# EAGLE design Board 2 (EAGLE 9.1.1)
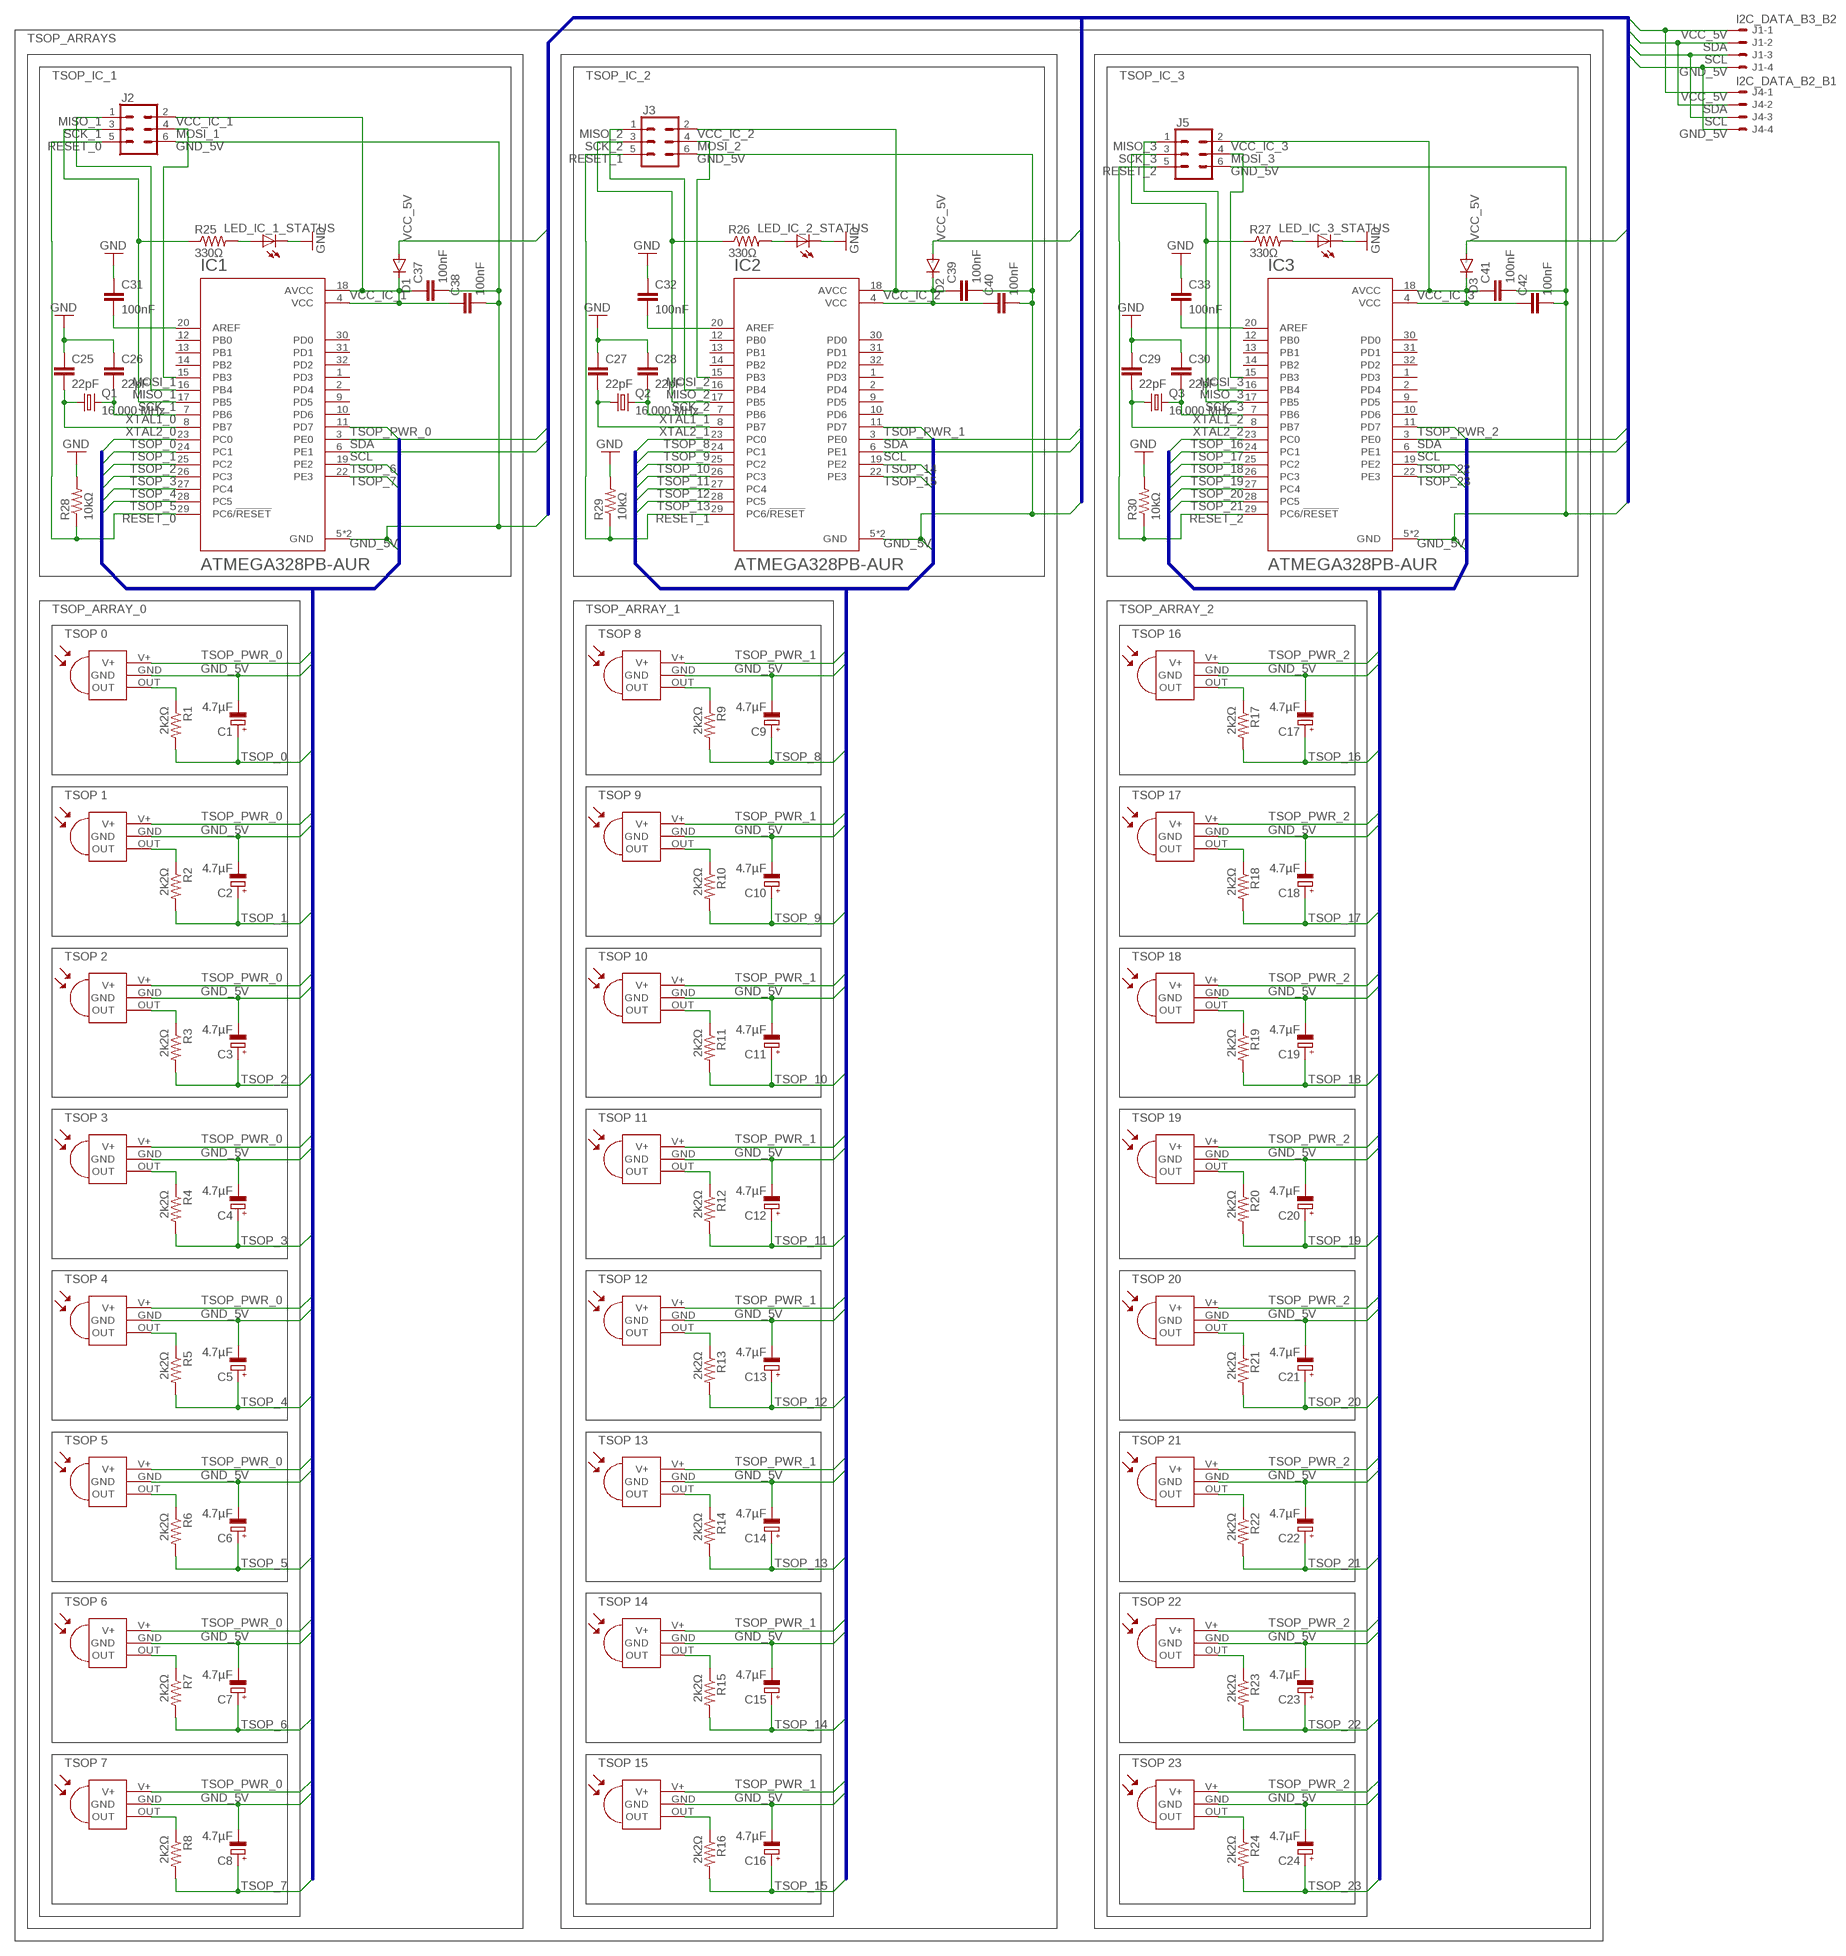
[diagram p0: schematic, sheet 1]

## Parts
C1  4.7µF  CPOL-EUE2-5  [E2-5]
C2  4.7µF  CPOL-EUE2-5  [E2-5]
C3  4.7µF  CPOL-EUE2-5  [E2-5]
C4  4.7µF  CPOL-EUE2-5  [E2-5]
C5  4.7µF  CPOL-EUE2-5  [E2-5]
C6  4.7µF  CPOL-EUE2-5  [E2-5]
C7  4.7µF  CPOL-EUE2-5  [E2-5]
C8  4.7µF  CPOL-EUE2-5  [E2-5]
C9  4.7µF  CPOL-EUE2-5  [E2-5]
C10  4.7µF  CPOL-EUE2-5  [E2-5]
C11  4.7µF  CPOL-EUE2-5  [E2-5]
C12  4.7µF  CPOL-EUE2-5  [E2-5]
C13  4.7µF  CPOL-EUE2-5  [E2-5]
C14  4.7µF  CPOL-EUE2-5  [E2-5]
C15  4.7µF  CPOL-EUE2-5  [E2-5]
C16  4.7µF  CPOL-EUE2-5  [E2-5]
C17  4.7µF  CPOL-EUE2-5  [E2-5]
C18  4.7µF  CPOL-EUE2-5  [E2-5]
C19  4.7µF  CPOL-EUE2-5  [E2-5]
C20  4.7µF  CPOL-EUE2-5  [E2-5]
C21  4.7µF  CPOL-EUE2-5  [E2-5]
C22  4.7µF  CPOL-EUE2-5  [E2-5]
C23  4.7µF  CPOL-EUE2-5  [E2-5]
C24  4.7µF  CPOL-EUE2-5  [E2-5]
C25  22pF  C-EU050-024X044  [C050-024X044]
C26  22pF  C-EU050-024X044  [C050-024X044]
C27  22pF  C-EU050-024X044  [C050-024X044]
C28  22pF  C-EU050-024X044  [C050-024X044]
C29  22pF  C-EU050-024X044  [C050-024X044]
C30  22pF  C-EU050-024X044  [C050-024X044]
C31  100nF  C-EU050-024X044  [C050-024X044]
C32  100nF  C-EU050-024X044  [C050-024X044]
C33  100nF  C-EU050-024X044  [C050-024X044]
C37  100nF  C-EU050-024X044  [C050-024X044]
C38  100nF  C-EU050-024X044  [C050-024X044]
C39  100nF  C-EU050-024X044  [C050-024X044]
C40  100nF  C-EU050-024X044  [C050-024X044]
C41  100nF  C-EU050-024X044  [C050-024X044]
C42  100nF  C-EU050-024X044  [C050-024X044]
D1  1N4148DO35-7  [DO35-7]
D2  1N4148DO35-7  [DO35-7]
D3  1N4148DO35-7  [DO35-7]
IC1  ATMEGA328PB-AUR  [QFP80P900X900X120-32N]
IC2  ATMEGA328PB-AUR  [QFP80P900X900X120-32N]
IC3  ATMEGA328PB-AUR  [QFP80P900X900X120-32N]
J1  I2C_DATA_B3_B2  22-27-2041-04  [6410-04]
J2  CONN_03X2SHROUD  [2X3-SHROUDED]
J3  CONN_03X2SHROUD  [2X3-SHROUDED]
J4  I2C_DATA_B2_B1  22-27-2041-04  [6410-04]
J5  CONN_03X2SHROUD  [2X3-SHROUDED]
LED_IC_1_STATUS  LEDP-LCC-2  [P-LCC-2]
LED_IC_2_STATUS  LEDP-LCC-2  [P-LCC-2]
LED_IC_3_STATUS  LEDP-LCC-2  [P-LCC-2]
Q1  16.000 MHz  CRYSTALHC49U-V  [HC49U-V]
Q2  16.000 MHz  CRYSTALHC49U-V  [HC49U-V]
Q3  16.000 MHz  CRYSTALHC49U-V  [HC49U-V]
R1  2k2Ω  R-US_0207/10  [0207/10]
R2  2k2Ω  R-US_0207/10  [0207/10]
R3  2k2Ω  R-US_0207/10  [0207/10]
R4  2k2Ω  R-US_0207/10  [0207/10]
R5  2k2Ω  R-US_0207/10  [0207/10]
R6  2k2Ω  R-US_0207/10  [0207/10]
R7  2k2Ω  R-US_0207/10  [0207/10]
R8  2k2Ω  R-US_0207/10  [0207/10]
R9  2k2Ω  R-US_0207/10  [0207/10]
R10  2k2Ω  R-US_0207/10  [0207/10]
R11  2k2Ω  R-US_0207/10  [0207/10]
R12  2k2Ω  R-US_0207/10  [0207/10]
R13  2k2Ω  R-US_0207/10  [0207/10]
R14  2k2Ω  R-US_0207/10  [0207/10]
R15  2k2Ω  R-US_0207/10  [0207/10]
R16  2k2Ω  R-US_0207/10  [0207/10]
R17  2k2Ω  R-US_0207/10  [0207/10]
R18  2k2Ω  R-US_0207/10  [0207/10]
R19  2k2Ω  R-US_0207/10  [0207/10]
R20  2k2Ω  R-US_0207/10  [0207/10]
R21  2k2Ω  R-US_0207/10  [0207/10]
R22  2k2Ω  R-US_0207/10  [0207/10]
R23  2k2Ω  R-US_0207/10  [0207/10]
R24  2k2Ω  R-US_0207/10  [0207/10]
R25  330Ω  R-US_0207/10  [0207/10]
R26  330Ω  R-US_0207/10  [0207/10]
R27  330Ω  R-US_0207/10  [0207/10]
R28  10kΩ  R-US_0207/10  [0207/10]
R29  10kΩ  R-US_0207/10  [0207/10]
R30  10kΩ  R-US_0207/10  [0207/10]
TSOP_1  TSOP14340  [TSOP143XX]
TSOP_2  TSOP14340  [TSOP143XX]
TSOP_3  TSOP14340  [TSOP143XX]
TSOP_4  TSOP14340  [TSOP143XX]
TSOP_5  TSOP14340  [TSOP143XX]
TSOP_6  TSOP14340  [TSOP143XX]
TSOP_7  TSOP14340  [TSOP143XX]
TSOP_8  TSOP14340  [TSOP143XX]
TSOP_9  TSOP14340  [TSOP143XX]
TSOP_10  TSOP14340  [TSOP143XX]
TSOP_11  TSOP14340  [TSOP143XX]
TSOP_12  TSOP14340  [TSOP143XX]
TSOP_13  TSOP14340  [TSOP143XX]
TSOP_14  TSOP14340  [TSOP143XX]
TSOP_15  TSOP14340  [TSOP143XX]
TSOP_16  TSOP14340  [TSOP143XX]
TSOP_17  TSOP14340  [TSOP143XX]
TSOP_18  TSOP14340  [TSOP143XX]
TSOP_19  TSOP14340  [TSOP143XX]
TSOP_20  TSOP14340  [TSOP143XX]
TSOP_21  TSOP14340  [TSOP143XX]
TSOP_22  TSOP14340  [TSOP143XX]
TSOP_23  TSOP14340  [TSOP143XX]
TSOP_24  TSOP14340  [TSOP143XX]

## Nets
GND_5V [+5V Power]: C1.- C2.- C3.- C4.- C5.- C6.- C7.- C8.- C9.- C10.- C11.- C12.- C13.- C14.- C15.- C16.- C17.- C18.- C19.- C20.- C21.- C22.- C23.- C24.- C25.1 C26.1 C27.1 C28.1 C29.1 C30.1 C31.1 C32.1 C33.1 C37.2 C38.2 C39.2 C40.2 C41.2 C42.2 IC1.5(GND) IC1.21(GND) IC2.5(GND) IC2.21(GND) IC3.5(GND) IC3.21(GND) J1.4 J2.6 J3.6 J4.4 J5.6 LED_IC_1_STATUS.C LED_IC_2_STATUS.C LED_IC_3_STATUS.C R28.2 R29.2 R30.2 TSOP_1.GND TSOP_2.GND TSOP_3.GND TSOP_4.GND TSOP_5.GND TSOP_6.GND TSOP_7.GND TSOP_8.GND TSOP_9.GND TSOP_10.GND TSOP_11.GND TSOP_12.GND TSOP_13.GND TSOP_14.GND TSOP_15.GND TSOP_16.GND TSOP_17.GND TSOP_18.GND TSOP_19.GND TSOP_20.GND TSOP_21.GND TSOP_22.GND TSOP_23.GND TSOP_24.GND ; supply symbol labelled GND
MISO_1: IC1.16(PB4) J2.1
MISO_2: IC2.16(PB4) J3.1
MISO_3: IC3.16(PB4) J5.1
MOSI_1: IC1.15(PB3) J2.4
MOSI_2: IC2.15(PB3) J3.4
MOSI_3: IC3.15(PB3) J5.4
N$1: R1.1 TSOP_1.OUT
N$2: R2.1 TSOP_2.OUT
N$3: R3.1 TSOP_3.OUT
N$4: R4.1 TSOP_4.OUT
N$5: R5.1 TSOP_5.OUT
N$6: R6.1 TSOP_6.OUT
N$7: R7.1 TSOP_7.OUT
N$8: R8.1 TSOP_8.OUT
N$9: R9.1 TSOP_9.OUT
N$10: R10.1 TSOP_10.OUT
N$11: R11.1 TSOP_11.OUT
N$12: R12.1 TSOP_12.OUT
N$13: R13.1 TSOP_13.OUT
N$14: R14.1 TSOP_14.OUT
N$15: R15.1 TSOP_15.OUT
N$16: R16.1 TSOP_16.OUT
N$17: R17.1 TSOP_17.OUT
N$18: R18.1 TSOP_18.OUT
N$19: R19.1 TSOP_19.OUT
N$20: R20.1 TSOP_20.OUT
N$21: R21.1 TSOP_21.OUT
N$22: R22.1 TSOP_22.OUT
N$23: R23.1 TSOP_23.OUT
N$24: R24.1 TSOP_24.OUT
N$25: LED_IC_1_STATUS.A R25.2
N$26: C31.2 IC1.20(AREF)
N$27: LED_IC_2_STATUS.A R26.2
N$28: C32.2 IC2.20(AREF)
N$29: LED_IC_3_STATUS.A R27.2
N$30: C33.2 IC3.20(AREF)
RESET_0: IC1.29(PC6/!RESET) J2.5 R28.1
RESET_1: IC2.29(PC6/!RESET) J3.5 R29.1
RESET_2: IC3.29(PC6/!RESET) J5.5 R30.1
SCK_1: IC1.17(PB5) J2.3 R25.1
SCK_2: IC2.17(PB5) J3.3 R26.1
SCK_3: IC3.17(PB5) J5.3 R27.1
SCL: IC1.6(PE1) IC2.6(PE1) IC3.6(PE1) J1.3 J4.3
SDA: IC1.3(PE0) IC2.3(PE0) IC3.3(PE0) J1.2 J4.2
TSOP_0: C1.+ IC1.23(PC0) R1.2
TSOP_1: C2.+ IC1.24(PC1) R2.2
TSOP_2: C3.+ IC1.25(PC2) R3.2
TSOP_3: C4.+ IC1.26(PC3) R4.2
TSOP_4: C5.+ IC1.27(PC4) R5.2
TSOP_5: C6.+ IC1.28(PC5) R6.2
TSOP_6: C7.+ IC1.19(PE2) R7.2
TSOP_7: C8.+ IC1.22(PE3) R8.2
TSOP_8: C9.+ IC2.23(PC0) R9.2
TSOP_9: C10.+ IC2.24(PC1) R10.2
TSOP_10: C11.+ IC2.25(PC2) R11.2
TSOP_11: C12.+ IC2.26(PC3) R12.2
TSOP_12: C13.+ IC2.27(PC4) R13.2
TSOP_13: C14.+ IC2.28(PC5) R14.2
TSOP_14: C15.+ IC2.19(PE2) R15.2
TSOP_15: C16.+ IC2.22(PE3) R16.2
TSOP_16: C17.+ IC3.23(PC0) R17.2
TSOP_17: C18.+ IC3.24(PC1) R18.2
TSOP_18: C19.+ IC3.25(PC2) R19.2
TSOP_19: C20.+ IC3.26(PC3) R20.2
TSOP_20: C21.+ IC3.27(PC4) R21.2
TSOP_21: C22.+ IC3.28(PC5) R22.2
TSOP_22: C23.+ IC3.19(PE2) R23.2
TSOP_23: C24.+ IC3.22(PE3) R24.2
TSOP_PWR_0: IC1.11(PD7) TSOP_1.V+ TSOP_2.V+ TSOP_3.V+ TSOP_4.V+ TSOP_5.V+ TSOP_6.V+ TSOP_7.V+ TSOP_8.V+
TSOP_PWR_1: IC2.11(PD7) TSOP_9.V+ TSOP_10.V+ TSOP_11.V+ TSOP_12.V+ TSOP_13.V+ TSOP_14.V+ TSOP_15.V+ TSOP_16.V+
TSOP_PWR_2: IC3.11(PD7) TSOP_17.V+ TSOP_18.V+ TSOP_19.V+ TSOP_20.V+ TSOP_21.V+ TSOP_22.V+ TSOP_23.V+ TSOP_24.V+
VCC_5V [+5V Power]: D1.A D2.A D3.A J1.1 J4.1
VCC_IC_1 [+5V Power]: C37.1 C38.1 D1.C IC1.4(VCC) IC1.18(AVCC) J2.2
VCC_IC_2 [+5V Power]: C39.1 C40.1 D2.C IC2.4(VCC) IC2.18(AVCC) J3.2
VCC_IC_3 [+5V Power]: C41.1 C42.1 D3.C IC3.4(VCC) IC3.18(AVCC) J5.2
XTAL1_0: C26.2 IC1.7(PB6) Q1.2
XTAL1_1: C28.2 IC2.7(PB6) Q2.2
XTAL1_2: C30.2 IC3.7(PB6) Q3.2
XTAL2_0: C25.2 IC1.8(PB7) Q1.1
XTAL2_1: C27.2 IC2.8(PB7) Q2.1
XTAL2_2: C29.2 IC3.8(PB7) Q3.1
Unconnected: IC1.1(PD3) IC1.2(PD4) IC1.9(PD5) IC1.10(PD6) IC1.12(PB0) IC1.13(PB1) IC1.14(PB2) IC1.30(PD0) IC1.31(PD1) IC1.32(PD2) IC2.1(PD3) IC2.2(PD4) IC2.9(PD5) IC2.10(PD6) IC2.12(PB0) IC2.13(PB1) IC2.14(PB2) IC2.30(PD0) IC2.31(PD1) IC2.32(PD2) IC3.1(PD3) IC3.2(PD4) IC3.9(PD5) IC3.10(PD6) IC3.12(PB0) IC3.13(PB1) IC3.14(PB2) IC3.30(PD0) IC3.31(PD1) IC3.32(PD2)

## Buses
TSOP_ARRAY_0:GND,TSOP_[0..7],TSOP_PWR_0
TSOP_ARRAY_1:GND,TSOP_[8..15],TSOP_PWR_1
TSOP_ARRAY_2:GND,TSOP_[16..23],TSOP_PWR_2
I2C:GND,SCL,SDA,VCC_MEGA

## Notes on the sheet
- TSOP_ARRAYS
- TSOP_IC_1 | TSOP_IC_2 | TSOP_IC_3
- TSOP_ARRAY_0 | TSOP_ARRAY_1 | TSOP_ARRAY_2
- TSOP 0 | TSOP 8 | TSOP 16
- TSOP 1 | TSOP 9 | TSOP 17
- TSOP 2 | TSOP 10 | TSOP 18
- TSOP 3 | TSOP 11 | TSOP 19
- TSOP 4 | TSOP 12 | TSOP 20
- TSOP 5 | TSOP 13 | TSOP 21
- TSOP 6 | TSOP 14 | TSOP 22
- TSOP 7 | TSOP 15 | TSOP 23

## Library data of the parts
C1-C24 = rcl:CPOL-EU: POLARIZED CAPACITOR, European symbol; SPICEPREFIX: C
C25-C33 C37-C42 = rcl:C-EU: CAPACITOR, European symbol; SPICEPREFIX: C
D1-D3 = diode:1N4148: DIODE high speed (Philips)
IC1-IC3 = ATMEGA328PB-AUR:ATMEGA328PB-AUR: ATmega Series 20 MHz 32 KB Flash 2 KB SRAM 8-Bit Microcontroller - TQFP-32; AVAILABILITY: Unavailable; DESCRIPTION: AVR microcontroller; EEPROM: 1024B; SRAM: 2kB; Flash: 32kB; TQFP32; MF: Microchip; MP: ATMEGA328PB-AUR; PACKAGE: TQFP-32 Microchip; PRICE: None
J1 J4 = con-molex:22-?-04: CONNECTOR wire to board 2.54 mm (.1 inch) pitch header; MF: MOLEX; OC_FARNELL: unknown; OC_NEWARK: unknown
J2 J3 J5 = SparkFun-Connectors:CONN_03X2: Multi connection point. Often used as Generic Header-pin footprint for 0.1 inch spaced/style header connections You can populate with any combo of single row headers, but if you'd like an exact match, check these: Header - 2x3 (Male, 0.1") <https://www.sparkfun.com/products/12807> (PRT-12807) Header - 2x3 (Female, 0.1") <https://www.sparkfun.com/products/13010> (PRT-13010) 2x3 Pin Shrouded Header <https://www.sparkfun.com/products/10877> (PRT-10877) On any of the 0.1 inch spaced packages, you can populate with these: Break Away Headers - Straight <https://www.sparkfun.com/products/116> (PRT-00116) Break Away Male Headers - Right Angle <https://www.sparkfun.com/products/553> (PRT-00553) Female Headers <https://www.sparkfun.com/products/115> (PRT-00115) Break Away Headers - Machine Pin <https://www.sparkfun.com/products/117> (PRT-00117) Break Away Female Headers - Swiss Machine Pin <https://www.sparkfun.com/products/743> (PRT-00743) Special note: the shrouded connector mates well with our 3x2 ribbon cables: Ribbon Crimp Connector - 6-pin (2x3, Female) <https://www.sparkfun.com/products/10651> (PRT-10651) Ribbon Cable - 6 wire (15ft) <https://www.sparkfun.com/products/10646> (PRT-10646); PROD_ID: CONN-10681; SF_ID: PRT_10877
LED_IC_1_STATUS LED_IC_2_STATUS LED_IC_3_STATUS = adafruit:LED: LED OSRAM: - CHIPLED LG R971, LG N971, LY N971, LG Q971, LY Q971, LO R971, LY R971 LH N974, LH R974 LS Q976, LO Q976, LY Q976 LO Q996 - Hyper CHIPLED LW Q18S LB Q993, LB Q99A, LB R99A - SideLED LS A670, LO A670, LY A670, LG A670, LP A670 LB A673, LV A673, LT A673, LW A673 LH A674 LY A675 LS A676, LA A676, LO A676, LY A676, LW A676 LS A679, LY A679, LG A679 - Hyper Micro SIDELED® LS Y876, LA Y876, LO Y876, LY Y876 LT Y87S - SmartLED LW L88C, LW L88S LB L89C, LB L89S, LG L890 LS L89K, LO L89K, LY L89K LS L896, LA L896, LO L896, LY L896 - TOPLED LS T670, LO T670, LY T670, LG T670, LP T670 LSG T670, LSP T670, LSY T670, LOP T670, LYG T670 LG T671, LOG T671, LSG T671 LB T673, LV T673, LT T673, LW T673 LH T674 LS T676, LA T676, LO T676, LY T676, LB T676, LH T676, LSB T676, LW T676 LB T67C, LV T67C, LT T67C, LS T67K, LO T67K, LY T67K, LW E67C LS E67B, LA E67B, LO E67B, LY E67B, LB E67C, LV E67C, LT E67C LW T67C LS T679, LY T679, LG T679 LS T770, LO T770, LY T770, LG T770, LP T770 LB T773, LV T773, LT T773, LW T773 LH T774 LS E675, LA E675, LY E675, LS T675 LS T776, LA T776, LO T776, LY T776, LB T776 LHGB T686 LT T68C, LB T68C - Hyper Mini TOPLED® LB M676 - Mini TOPLED Santana® LG M470 LS M47K, LO M47K, LY M47K Source: http://www.osram.convergy.de/
Q1-Q3 = crystal:CRYSTAL: CRYSTAL; OC_FARNELL: 1666969; OC_NEWARK: unknown
R1-R30 = resistor:R-US_: RESISTOR, American symbol
TSOP_1-TSOP_24 = TSOP 14340:TSOP14340

## Net classes
1 +12V Power: width 2.032 mm, drill 1.397 mm, clearance 0.356 mm
2 +5V Power: width 0.508 mm, drill 0.61 mm, clearance 0.203 mm

## Board
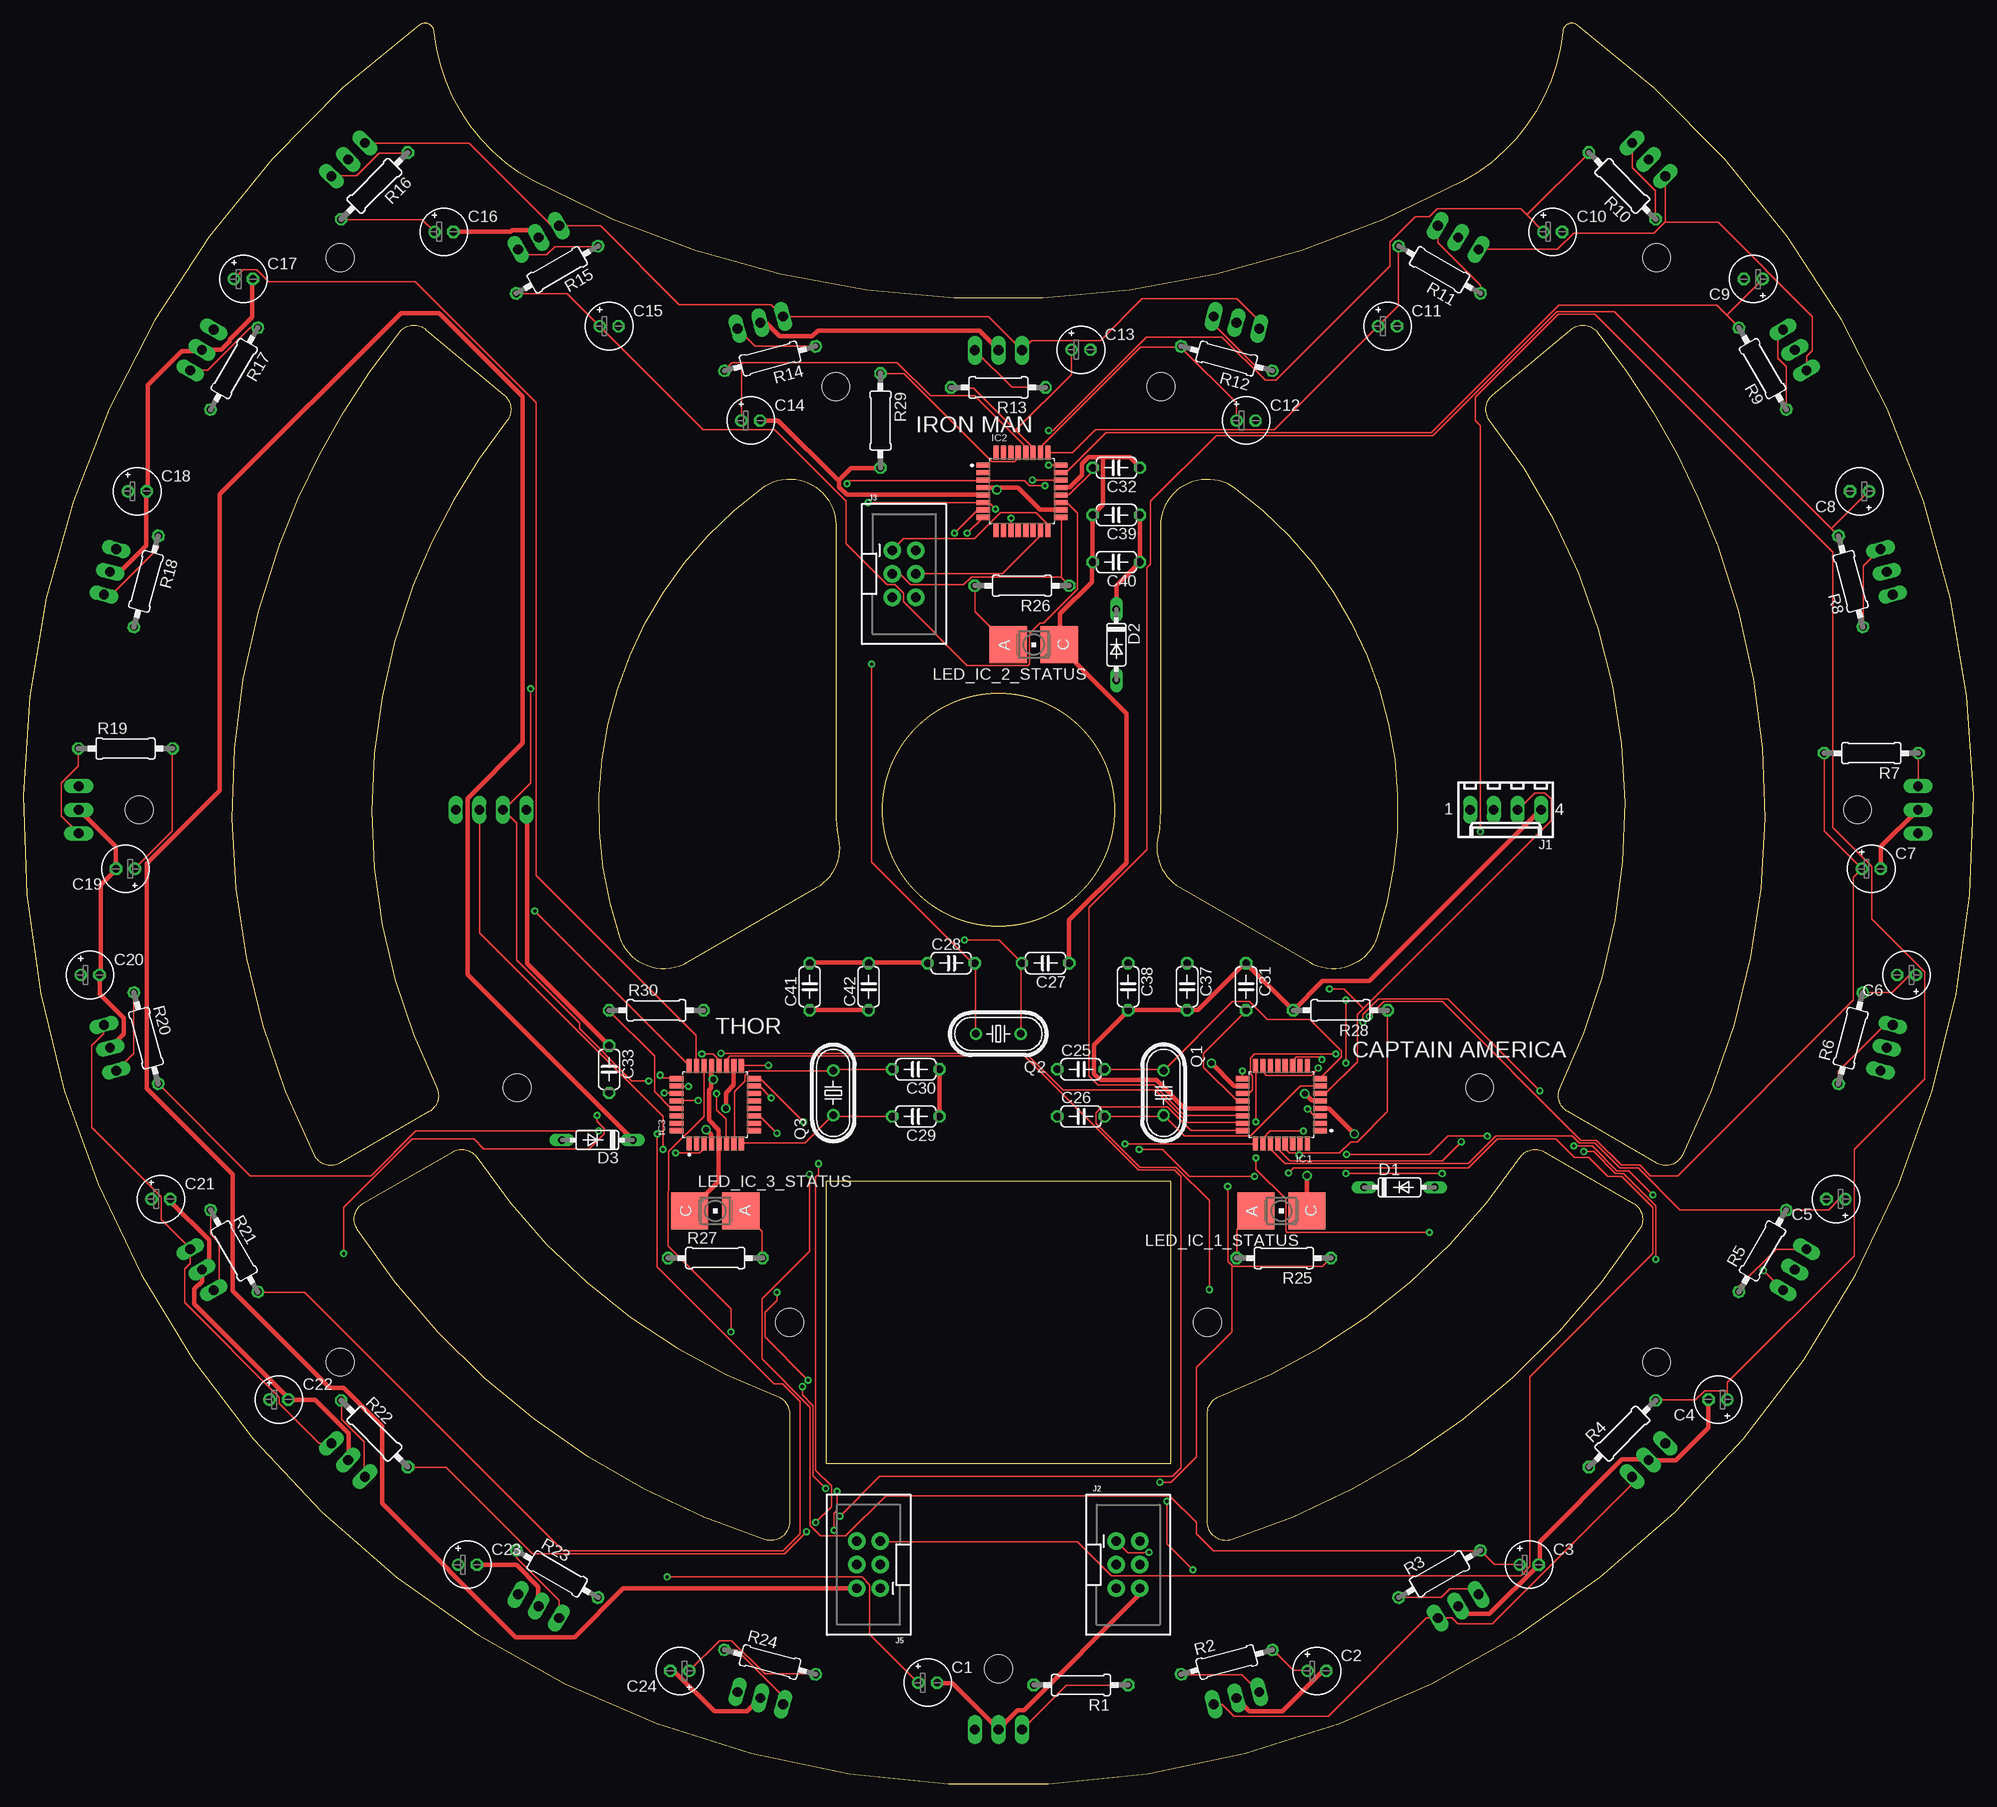
[diagram p1: board, top side]
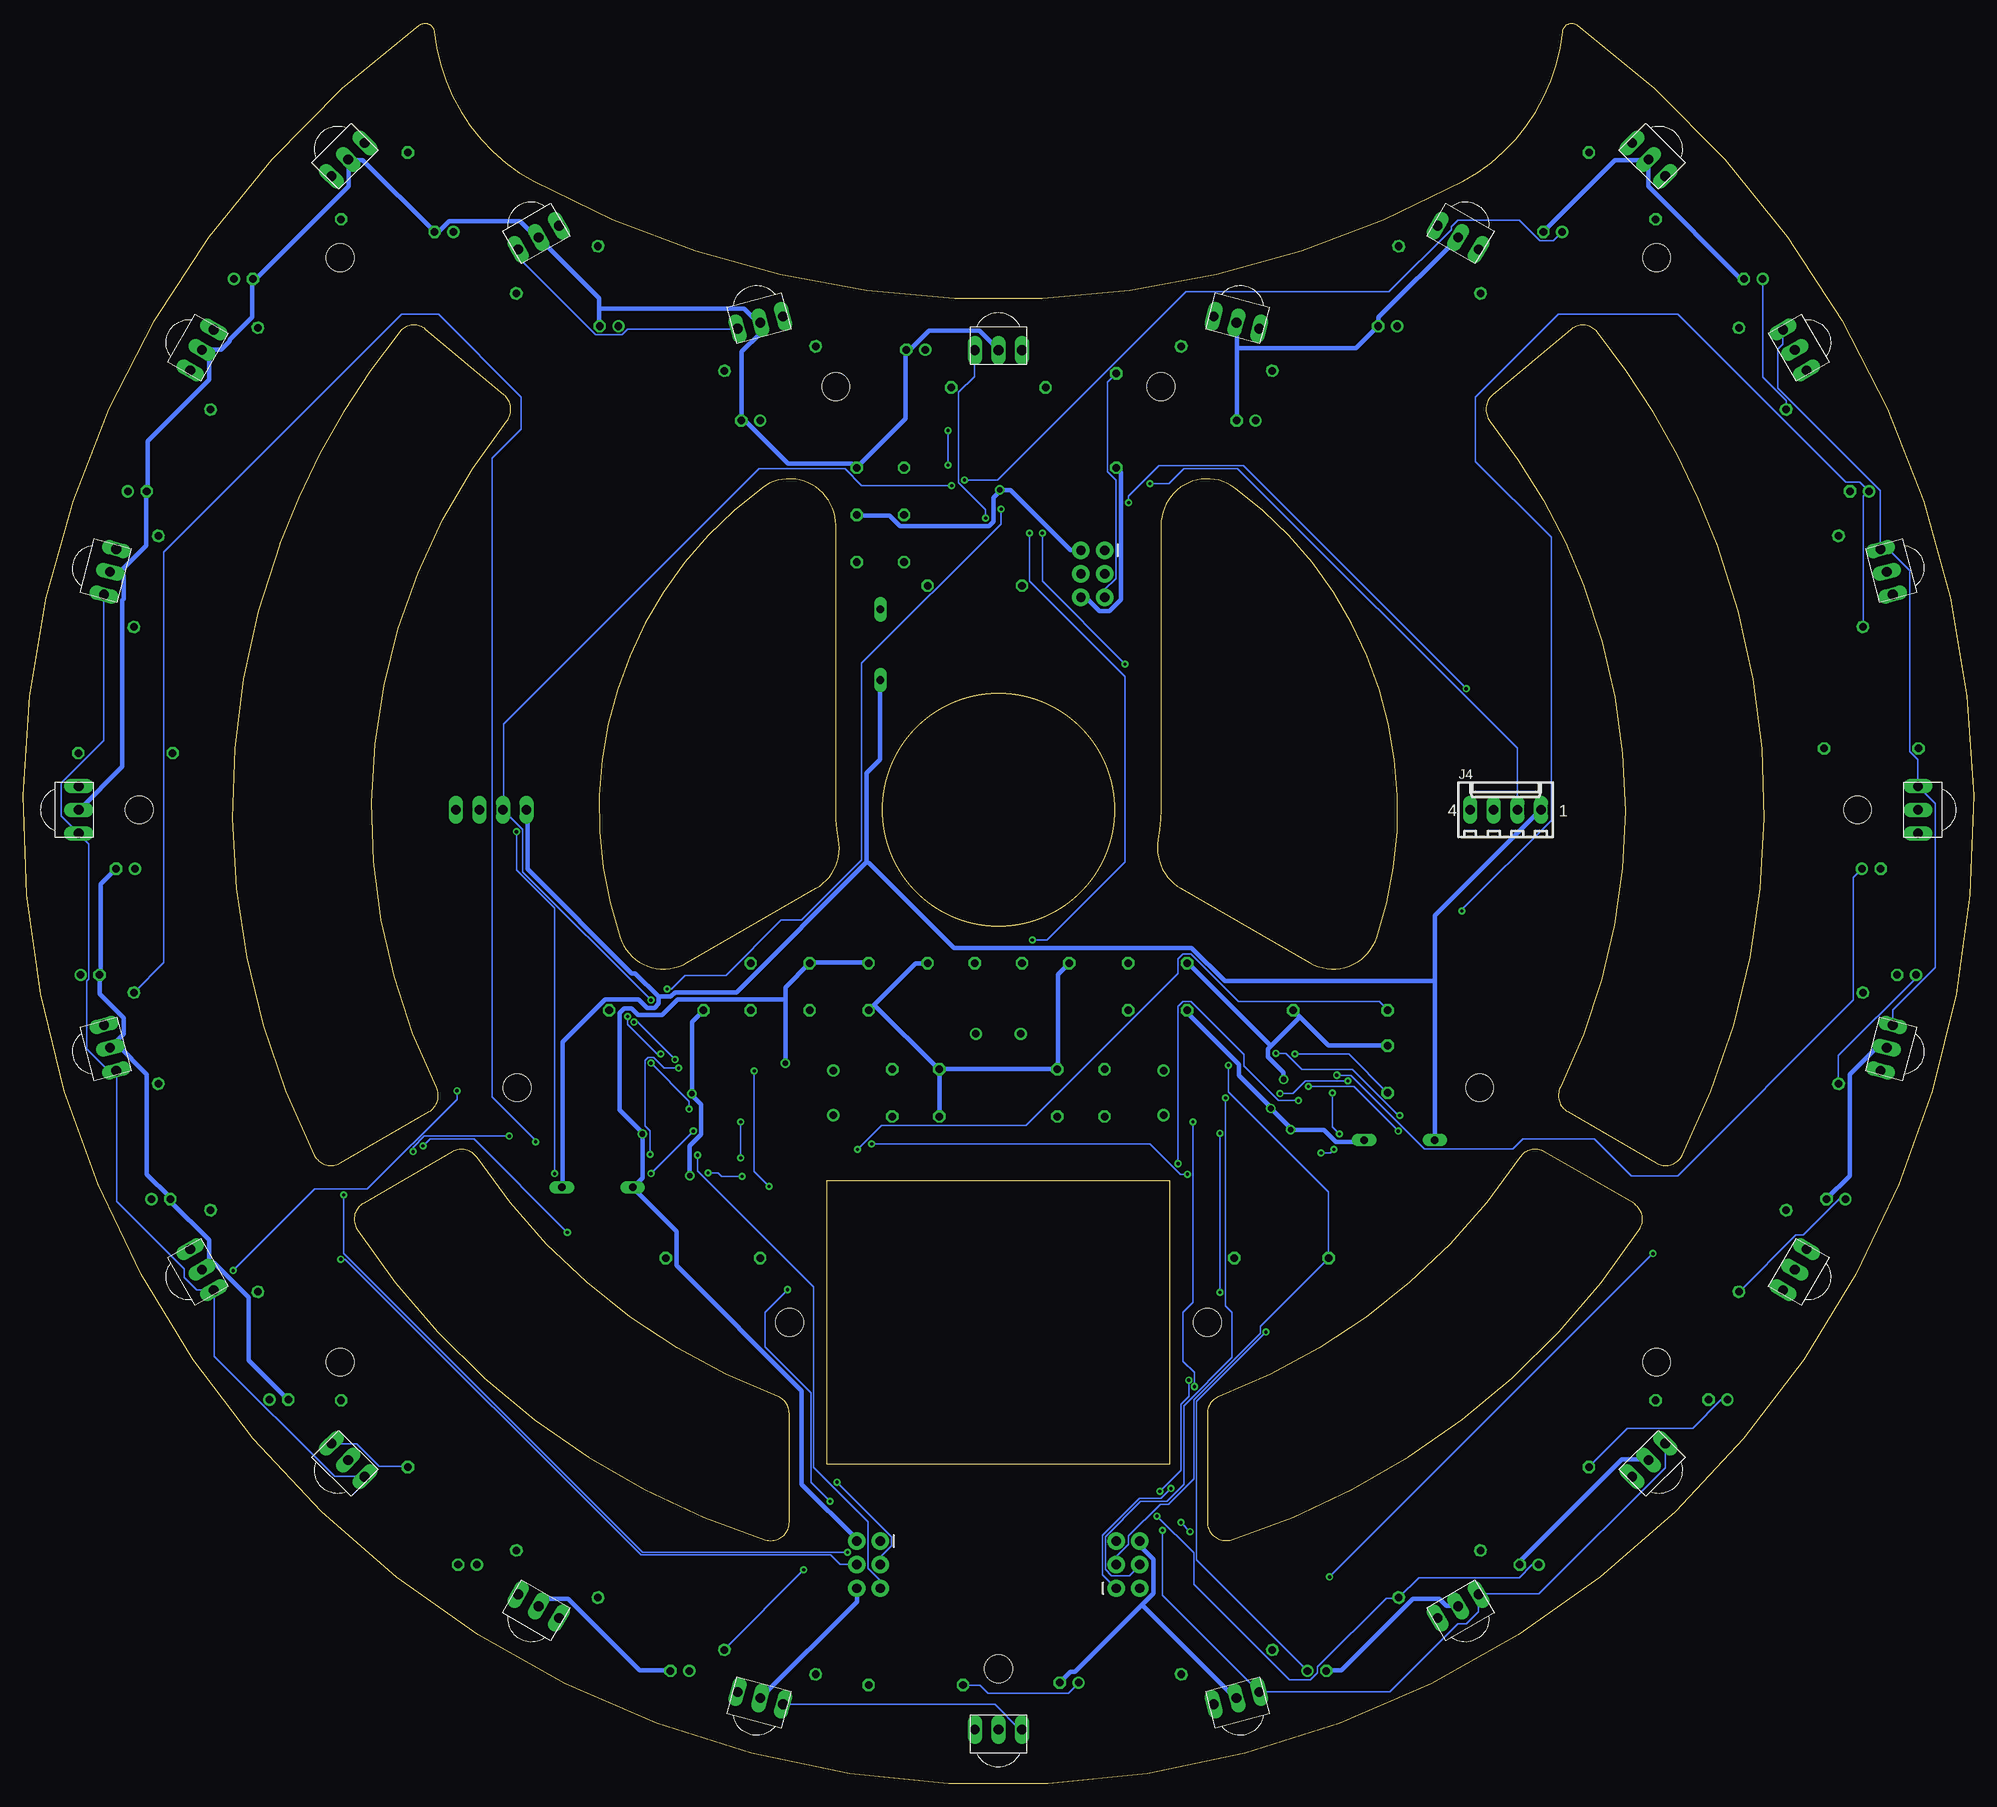
[diagram p2: board, bottom side, seen from below]

Size 209.98 x 189.55 mm. Coordinates in mm from the lower left corner, seen from the top.
Outline: 44.24,188.65 arc121 42.65,189.35 arc287 167.33,189.35 arc121 165.74,188.65 arc-56 154.99,172.53 arc-57 54.99,172.53 arc-56 44.24,188.65
Outline: 36.64,62.51 46.21,68.03 arc-86 48.87,67.41 arc36 81.2,41.73 arc-69 82.49,39.86 82.49,28.19 arc-108 79.88,26.29 arc-39 35.97,59.69 arc-93 36.64,62.51
Outline: 173.35,62.51 arc-93 174.02,59.68 arc-39 130.1,26.28 arc-108 127.49,28.18 127.49,39.86 arc-69 128.79,41.73 arc36 161.11,67.41 arc-86 163.78,68.03 173.35,62.51
Outline: 165.49,74.98 arc65 157.91,146.73 arc-88 158.19,149.5 166.63,156.58 arc-91 169.48,156.3 arc-18 182.29,133.65 arc-7 182.38,133.44 arc-47 178.63,67.67 arc-93 175.84,66.84 166.28,72.36 arc-86 165.49,74.98
Outline: 87.78,101.66 arc-71 85.37,96.42 71.48,88.4 arc-101 64.24,91.14 arc-72 79.53,139.52 arc-126 87.49,135.49 87.49,104.86 arc11 87.78,101.66
Outline: 122.49,135.49 arc-126 130.45,139.52 arc-72 145.74,91.13 arc-101 138.5,88.4 124.61,96.42 arc-71 122.2,101.66 arc11 122.49,104.86 122.49,135.49
Outline: 123.49,64.93 123.49,34.43 86.49,34.43 86.49,64.93 123.49,64.93
Outline: 52.07,146.73 arc17 41.95,128.94 arc-1 41.94,128.89 arc47 44.49,74.98 arc-86 43.7,72.36 34.14,66.84 arc-93 31.36,67.67 arc-47 27.61,133.44 arc-3 27.64,133.52 arc-18 40.5,156.3 arc-91 43.35,156.58 51.79,149.5 arc-88 52.07,146.73
Outline: circle at 104.99,104.86 radius 12.5
Copper layers (1*16): Top 0.035mm / dielectric 1.5mm / Bottom 0.035mm
Design rules "default": minimum track width 6mil, minimum drill 0.35mm, track to track 6mil, track to pad 6mil, pad to pad 6mil, via to via 6mil, smd to smd 6mil, copper to edge 40mil, drill to drill 6mil, minimum pad ring 10mil, minimum via ring 8mil, stop-mask expansion 4mil, vias tented up to drill 0mil, thermal gap 10mil
Holes 3 mm at 34.13,164.32 12.5,104.86 34.13,45.4 104.99,12.36 82.49,49.68 127.49,49.68 175.85,45.4 156.81,74.95 197.48,104.86 175.85,164.32 122.49,150.41 87.49,150.41 53.17,74.95

### Footprints (pad centres in the part's own frame; a part is rotated, then mirrored left to right if it is on the bottom)
E2-5 = drill 0.813 pad 1.27: + -1.016,0 | drill 0.813 pad 1.27 octagon: - 1.016,0
C050-024X044 = drill 0.813 octagon: 1 -2.54,0; 2 2.54,0
DO35-7 = drill 0.813 long: A 3.81,0; C -3.81,0
QFP80P900X900X120-32N = smd 1.47 x 0.55: 1 -4.17,2.8; 2 -4.17,2; 3 -4.17,1.2; 4 -4.17,0.4; 5 -4.17,-0.4; 6 -4.17,-1.2; 7 -4.17,-2; 8 -4.17,-2.8; 17 4.17,-2.8; 18 4.17,-2; 19 4.17,-1.2; 20 4.17,-0.4; 21 4.17,0.4; 22 4.17,1.2; 23 4.17,2; 24 4.17,2.8 | smd 0.55 x 1.47: 9 -2.8,-4.17; 10 -2,-4.17; 11 -1.2,-4.17; 12 -0.4,-4.17; 13 0.4,-4.17; 14 1.2,-4.17; 15 2,-4.17; 16 2.8,-4.17; 25 2.8,4.17; 26 2,4.17; 27 1.2,4.17; 28 0.4,4.17; 29 -0.4,4.17; 30 -1.2,4.17; 31 -2,4.17; 32 -2.8,4.17
6410-04 = drill 1.016 long: 1 3.81,0; 2 1.27,0; 3 -1.27,0; 4 -3.81,0
2X3-SHROUDED = drill 1.016 pad 1.88: 1 -1.27,2.54; 2 1.27,2.54; 3 -1.27,0; 4 1.27,0; 5 -1.27,-2.54; 6 1.27,-2.54
P-LCC-2 = smd 4 x 4: A 0,2.75; C 0,-2.75
HC49U-V = drill 0.813: 1 -2.413,0; 2 2.413,0
0207/10 = drill 0.813 octagon: 1 -5.08,0; 2 5.08,0
TSOP143XX = drill 1.05 long: GND -0.99,0; OUT -0.99,-2.54; V+ -0.99,2.54

### Placement (x,y rotation side)
C1  97.37,10.88 0 top
C2  139.28,12.15 0 top
C3  162.14,23.58 0 top
C4  182.46,41.36 180 top
C5  195.16,62.95 180 top
C6  202.78,87.08 180 top
C7  198.97,98.51 0 top
C8  197.7,139.15 180 top
C9  186.27,162.01 180 top
C10  164.68,167.09 0 top
C11  146.9,156.93 0 top
C12  131.66,146.77 0 top
C13  113.88,154.39 0 top
C14  78.32,146.77 0 top
C15  63.08,156.93 0 top
C16  45.3,167.09 0 top
C17  23.71,162.01 0 top
C18  12.28,139.15 0 top
C19  11.01,98.51 180 top
C20  7.2,87.08 0 top
C21  14.82,62.95 0 top
C22  27.52,41.36 0 top
C23  47.84,23.58 0 top
C24  70.7,12.15 180 top
C25  113.88,76.92 0 top
C26  113.88,71.84 0 top
C27  110.07,88.35 180 top
C28  99.91,88.35 0 top
C29  96.1,71.84 180 top
C30  96.1,76.92 180 top
C31  131.66,85.81 270 top
C32  117.69,141.69 180 top
C33  63.08,76.92 270 top
C37  125.31,85.81 270 top
C38  118.96,85.81 270 top
C39  117.69,136.61 180 top
C40  117.69,131.53 180 top
C41  84.67,85.81 90 top
C42  91.02,85.81 90 top
D1  148.17,64.22 0 top
D2  117.69,122.64 270 top
D3  61.81,69.3 180 top
IC1  135.47,73.11 180 top
IC2  107.53,139.15 0 top
IC3  74.51,73.11 90 top
J1  159.6,104.86 180 top
J2  118.96,23.58 0 top
J3  94.83,130.26 0 top
J4  50.38,104.86 0 bottom
J5  91.02,23.58 180 top
LED_IC_1_STATUS  135.47,61.68 90 top
LED_IC_2_STATUS  108.8,122.64 90 top
LED_IC_3_STATUS  74.51,61.68 270 top
Q1  122.77,74.38 270 top
Q2  104.99,80.73 180 top
Q3  87.21,74.38 90 top
R1  113.88,10.63 180 top
R2  129.58,13.1 15 top
R3  152.49,22.59 30 top
R4  172.16,37.69 45 top
R5  187.26,57.36 60 top
R6  196.75,80.27 75 top
R7  198.97,110.96 180 top
R8  196.75,129.45 105 top
R9  187.26,152.36 120 top
R10  172.16,172.04 135 top
R11  152.49,163 150 top
R12  129.58,153.44 165 top
R13  104.99,150.33 180 top
R14  80.4,153.44 195 top
R15  57.49,163 210 top
R16  37.81,172.04 225 top
R17  22.72,152.36 240 top
R18  13.23,129.45 255 top
R19  11.01,111.46 0 top
R20  13.23,80.27 285 top
R21  22.72,57.36 300 top
R22  37.81,37.69 315 top
R23  57.49,22.59 330 top
R24  80.4,13.1 345 top
R25  135.72,56.6 180 top
R26  107.53,128.99 180 top
R27  74.51,56.6 0 top
R28  141.82,83.27 180 top
R29  92.29,146.77 270 top
R30  68.16,83.27 0 top
TSOP_1  104.99,4.86 270 bottom
TSOP_2  130.87,8.27 255 bottom
TSOP_3  154.99,18.26 240 bottom
TSOP_4  175.7,34.15 225 bottom
TSOP_5  191.59,54.86 210 bottom
TSOP_6  201.58,78.98 195 bottom
TSOP_7  204.99,104.86 180 bottom
TSOP_8  201.58,130.74 165 bottom
TSOP_9  191.59,154.86 150 bottom
TSOP_10  175.7,175.57 135 bottom
TSOP_11  154.99,167.33 120 bottom
TSOP_12  130.87,158.27 105 bottom
TSOP_13  104.99,155.33 90 bottom
TSOP_14  79.11,158.27 75 bottom
TSOP_15  54.99,167.33 60 bottom
TSOP_16  34.28,175.57 45 bottom
TSOP_17  18.39,154.86 30 bottom
TSOP_18  8.4,130.74 15 bottom
TSOP_19  4.99,104.86 0 bottom
TSOP_20  8.4,78.98 345 bottom
TSOP_21  18.39,54.86 330 bottom
TSOP_22  34.28,34.15 315 bottom
TSOP_23  54.99,18.26 300 bottom
TSOP_24  79.11,8.27 285 bottom

### Tracks (layer width: path | path; a pad name or v marks a point on that pad's centre or on a via)
GND_5V  (via drill 0.61)
  Top 0.508: C2.- 140.27,12.13 139.89,12.13 135.54,7.78 132.04,7.78 130.67,9.15 TSOP_2.GND | C7.- 200.01,98.54 200.01,100.9 203.97,104.86 TSOP_7.GND | TSOP_3.GND 154.52,19.06 155.28,18.3 157.87,18.3 C3.- 163.28,23.78 163.28,26.07 172.12,34.91 174.79,34.91 TSOP_4.GND 175.02,34.83 177.91,34.83 181.42,38.34 181.42,41.31 C4.- | C1.- 98.44,10.83 100.04,10.83 104.99,5.88 TSOP_1.GND 105.14,6.03 107.05,7.94 107.73,7.94 120.23,20.43 J2.6 | C23.- 48.91,23.56 53.1,23.56 55.46,21.19 55.46,19.14 TSOP_23.GND | C24.- 69.71,12.13 70.09,12.13 74.43,7.78 77.94,7.78 79.31,9.15 TSOP_24.GND | TSOP_20.GND 9.36,79.26 10.81,80.71 10.81,82.46 8.21,85.05 C20.- 8.37,87.26 8.37,96.78 9.89,98.31 C19.- 9.97,98.54 9.97,100.9 6,104.86 TSOP_19.GND | C21.- 15.83,62.72 20.03,58.53 20.03,56.17 19.26,55.41 TSOP_21.GND 19.26,55.1 19.26,54.11 18.43,53.27 18.43,51.67 28.48,41.62 C22.- 28.56,41.31 31.46,41.31 35.04,37.73 35.04,34.91 TSOP_22.GND | LED_IC_3_STATUS.C 71.77,61.73 74.89,64.86 74.89,68.9 IC3.5 74.89,69.2 74.89,70.42 73.82,71.49 73.82,74.69 74.05,74.91 74.05,75.83 | 74.05,75.83 74.05,77.28 IC3.21 | J4.4 54.24,104.86 54.24,88.33 63.08,79.49 C33.1 | v74.28,75.83 74.05,75.83 | C29.1 98.66,71.87 98.66,76.9 C30.1 | C41.2 84.72,88.4 90.97,88.4 C42.2 91.2,88.4 97.37,88.4 C28.1 | IC1.21 131.28,72.71 125.03,72.71 121.98,75.75 115.96,75.75 115.28,76.44 115.28,79.56 118.93,83.22 C38.2 119.16,83.3 125.26,83.3 C37.2 125.56,83.3 126.48,83.3 131.43,88.25 C31.1 131.66,88.33 136.69,83.3 R28.2 139.89,86.42 144.92,86.42 163.36,104.86 J1.4 | v137.98,74.31 138.75,73.54 139.58,73.54 IC1.5
  Top 0.508: v138.21,65.47 138.21,61.73 LED_IC_1_STATUS.C | 87.84,140.37 87.84,139.61 88.68,138.77 103.31,138.77 IC2.5 | 87.84,140.37 89.14,141.67 92.26,141.67 R29.2 | C14.- 81.29,146.77 87.61,140.45 87.84,140.37 | TSOP_18.GND 9.36,130.54 10.5,130.54 13.24,133.28 13.24,139.15 C18.- 13.4,139.38 13.4,150.58 17.05,154.24 19.03,154.24 TSOP_17.GND 19.26,154.39 21.32,154.39 22.24,155.31 22.24,155.46 24.67,157.9 24.67,162.01 C17.- | C16.- 46.31,167.12 52.49,167.12 52.64,167.27 54.7,167.27 55.46,166.51 TSOP_15.GND | 116.27,142.81 119.16,142.81 120.23,141.74 C32.1 | 116.27,142.81 114.67,142.81 113.98,142.12 113.98,140.9 112.68,139.61 111.77,139.61 IC2.21 | 116.27,142.81 116.27,137.7 115.35,136.79 C39.2 115.12,136.56 115.12,131.53 C40.2 115.05,131.3 115.05,129.4 111.62,125.97 111.62,122.69 LED_IC_2_STATUS.C 111.62,122.39 118.78,115.22 118.78,99.15 112.61,92.97 C27.1 | TSOP_14.GND 79.39,157.29 79.99,157.29 81.44,155.84 84.95,155.84 85.56,156.45 102.93,156.45 104.99,154.39 TSOP_13.GND
  Bottom 0.508: J2.6 120.23,19.59 130.59,9.23 TSOP_2.GND | C7.- 200.01,98.46 201.61,96.86 201.61,87.26 C6.- 201.76,85.05 199.17,82.46 199.17,80.71 200.62,79.26 TSOP_6.GND 199.93,79.64 196.66,76.36 196.66,65.62 194.22,63.18 C5.- 194.14,62.72 189.95,58.53 189.95,56.17 190.71,55.41 TSOP_5.GND 189.72,56.09 189.42,56.09 185.68,52.36 185.68,45.58 181.49,41.39 C4.- | C2.- 140.35,12.2 143.62,12.2 151.32,19.9 153.68,19.9 154.44,19.14 TSOP_3.GND | J5.6 89.75,25.61 88.3,24.17 88.3,20.51 89.52,19.29 | 89.52,19.29 96.76,12.05 97.22,12.05 C1.- | TSOP_23.GND 55.53,19.14 56.75,19.14 57.52,19.9 60.34,19.9 68.03,12.2 69.63,12.2 C24.- | 89.52,19.29 79.39,9.15 TSOP_24.GND | C21.- 13.32,65.47 13.32,76.36 10.5,79.18 9.36,79.18 TSOP_20.GND | C23.- 48.83,23.63 48.83,23.94 37.86,34.91 35.04,34.91 TSOP_22.GND | 72.53,82.53 73.21,83.22 R30.2 | 72.53,82.53 69.48,79.49 63.08,79.49 C33.1 | v74.28,75.83 74.28,76.59 75.96,78.27 75.96,79.11 75.65,79.41 | 72.53,82.53 75.65,79.41 | C28.1 97.37,88.33 98.59,87.11 98.59,76.97 C30.1 98.82,76.97 111.08,76.97 C25.1 | C26.1 111.31,71.87 111.31,76.9 C25.1 | C38.2 118.36,83.87 | 118.36,83.87 113.9,88.33 112.61,88.33 C27.1 | 118.36,83.87 111.54,77.05 C25.1 | R28.2 136.76,83.22 137.98,82 v137.98,74.31 137.91,74.08 136.99,73.16 136.99,69.89 138.21,68.67 v138.21,65.47 | 75.65,79.41 84.64,88.4 C41.2 | 79.31,154.54 79.31,157.29 TSOP_14.GND | 79.31,154.54 79.31,146.77 C14.- | J3.6 95.54,127.72 94.09,126.27 93.03,126.27 91.81,127.49 91.81,141.21 R29.2 | TSOP_15.GND 55.53,166.43 64.07,157.9 64.07,156.98 C15.- 64.3,156.75 66.51,154.54 79.31,154.54 | C16.- 46.31,167.12 38.62,174.81 35.04,174.81 TSOP_16.GND 35.04,174.58 35.04,171.99 25.05,162.01 C17.-
  Bottom 0.508: 147.97,158.81 147.97,159.95 154.44,166.43 TSOP_11.GND 154.75,166.51 156.5,168.26 164.12,168.26 165.26,167.12 165.64,167.12 C10.- 173.42,174.81 174.94,174.81 TSOP_10.GND 174.94,174.58 174.94,171.99 184.77,162.16 185.07,162.16 C9.- 185.3,162.01 185.3,157.9 187.74,155.46 187.74,155.31 188.66,154.39 190.71,154.39 TSOP_9.GND 189.95,154.16 189.95,151.19 196.58,144.56 196.58,139.38 C8.- 196.73,139.15 196.73,133.28 199.48,130.54 200.62,130.54 TSOP_8.GND 199.4,130.31 199.17,130.08 199.17,127.57 199.32,127.42 199.32,109.51 203.97,104.86 TSOP_7.GND | 147.97,158.81 147.97,156.98 C11.- | TSOP_13.GND 104.99,154.39 107.05,156.45 112.46,156.45 114.51,154.39 C13.- 114.97,154.16 114.97,147 120.23,141.74 C32.1 120.46,141.82 120.76,142.12 127.62,142.12 132.19,146.7 132.42,146.7 C12.- 132.65,146.77 132.65,154.16 130.67,156.14 130.67,157.29 TSOP_12.GND 130.9,157.36 132.34,158.81 147.97,158.81
MISO_1  (via drill 0.35)
  Top 0.152: v132.73,71.26 132.73,77.28 IC1.16 | v132.73,67.37 132.73,66.15 135.93,62.95 135.93,59.52 136.08,59.37 v151.39,59.37 | v166.94,68.67 168.92,68.67 171.59,66 172.88,66 v175.47,63.41 | v121.22,24.93 120.76,24.93 120.69,24.85 118.93,24.85 117.71,26.07 J2.1
  Bottom 0.152: v132.73,67.37 v132.73,71.26 | v151.39,59.37 161.45,69.43 166.18,69.43 v166.94,68.67 | v175.47,63.41 175.47,57.08 143.32,24.93 v121.22,24.93
MISO_2
  Top 0.152: IC2.16 110.32,135.04 110.32,135.57 109.03,136.87 105.22,136.87 102.4,134.05 94.78,134.05 93.56,132.83 J3.1
MISO_3  (via drill 0.35)
  Top 0.152: v84.03,71.26 79.39,75.91 78.7,75.91 IC3.16 | v83.88,42.76 83.88,41.84 85.02,40.7 85.02,33.16 v86.4,31.79
  Bottom 0.152: v84.03,71.26 84.03,51.83 85.1,50.76 85.1,45.5 83.88,44.28 v83.88,42.76 | v86.4,31.79 87.46,30.72 89.82,30.72 93.79,26.76 93.79,22.49 92.34,21.04 J5.1
MOSI_1  (via drill 0.35)
  Top 0.152: v139.43,77.05 138.67,76.29 133.87,76.29 133.49,76.67 133.49,77.28 IC1.15 | v142.48,67.75 151.39,67.75 153.38,69.73 v157.64,69.73 | v168.01,68.06 169.07,68.06 171.43,65.69 172.27,65.69 175.78,62.19 v175.78,56.47
  Bottom 0.152: v139.43,77.05 140.95,77.05 142.1,78.19 142.71,78.19 143.01,77.89 143.01,70.8 142.48,70.27 v142.48,67.75 | v157.64,69.73 166.79,69.73 168.01,68.51 v168.01,68.06 | v175.78,56.47 175.32,56.47 143.47,24.62 123.05,24.62 122.06,23.63 120.23,23.63 J2.4
MOSI_2
  Top 0.152: IC2.15 109.48,134.96 109.48,134.35 105.45,130.31 96.15,130.31 J3.4
MOSI_3  (via drill 0.35)
  Top 0.152: v80.53,73.85 79.31,75.07 78.7,75.07 IC3.15
  Bottom 0.152: v80.53,73.85 80.53,51.45 79.84,50.76 79.84,45.88 85.02,40.7 85.02,32.24 86.85,30.41 89.67,30.41 93.48,26.6 93.48,23.1 92.8,22.41 90.89,22.41 89.75,23.56 J5.4
N$1
  Top 0.152: R1.1 118.93,10.6 112.3,10.6 107.58,5.88 TSOP_1.OUT
N$2
  Top 0.152: R2.1 124.72,11.75 131.2,11.75 133.03,9.92 TSOP_2.OUT
N$3
  Top 0.152: R3.1 148.12,20.05 152.69,20.05 153.6,20.97 156.12,20.97 156.65,20.43 TSOP_3.OUT
N$4
  Bottom 0.152: R4.1 168.62,34.15 171.66,34.15 174.1,36.59 176.77,36.59 TSOP_4.OUT
N$5
  Top 0.152: R5.1 184.77,52.97 184.77,53.58 188.73,57.54 191.93,57.54 TSOP_5.OUT
N$6
  Top 0.152: R6.1 195.44,76.67 200.39,81.62 201.23,81.62 TSOP_6.OUT
N$7
  Top 0.152: R7.1 204.05,107.45 TSOP_7.OUT
N$8
  Top 0.152: R8.1 198.1,124.6 198.1,131.07 199.93,132.9 TSOP_8.OUT
N$9
  Top 0.152: R9.1 189.8,147.99 189.8,152.56 188.88,153.48 188.88,155.99 189.42,156.53 TSOP_9.OUT
N$10
  Top 0.152: R10.1 175.7,168.49 175.7,171.54 173.26,173.97 173.26,176.64 TSOP_10.OUT
N$11
  Top 0.152: R11.1 156.88,160.49 156.88,161.33 152.31,165.9 152.31,167.73 TSOP_11.OUT
N$12
  Top 0.152: R12.1 134.48,152.18 133.11,152.18 128.23,157.06 128.23,157.97 TSOP_12.OUT
N$13
  Top 0.152: R13.1 110.02,150.35 106.44,150.35 102.47,154.32 TSOP_13.OUT
N$14
  Top 0.152: R14.1 85.25,154.77 78.78,154.77 76.95,156.6 TSOP_14.OUT
N$15
  Top 0.152: R15.1 61.86,165.52 57.29,165.52 56.37,164.6 53.86,164.6 53.32,165.14 TSOP_15.OUT
N$16
  Top 0.152: R16.1 41.36,175.58 38.31,175.58 35.88,173.14 33.21,173.14 TSOP_16.OUT
N$17
  Top 0.152: R17.1 25.21,156.75 24.45,156.75 19.87,152.18 18.04,152.18 TSOP_17.OUT
N$18
  Top 0.152: R18.1 14.54,133.06 9.59,128.1 8.75,128.1 TSOP_18.OUT
N$19
  Top 0.152: R19.1 5.93,109.59 4.1,107.76 4.1,104.18 5.93,102.35 TSOP_19.OUT
N$20
  Top 0.152: R20.1 11.87,85.13 11.87,78.65 10.04,76.82 TSOP_20.OUT
N$21
  Top 0.152: R21.1 20.18,61.73 20.18,59.14 21.09,58.23 21.09,53.73 20.56,53.2 TSOP_21.OUT
N$22
  Top 0.152: R22.1 34.27,41.23 34.27,39.25 36.71,36.81 36.71,33.08 TSOP_22.OUT
N$23
  Top 0.152: R23.1 53.1,25.08 53.1,24.32 57.67,19.75 57.67,17.92 TSOP_23.OUT
N$24
  Top 0.152: R24.1 76.79,14.41 81.75,9.46 81.75,8.62 TSOP_24.OUT
N$25
  Top 0.152: R25.2 130.67,56.63 130.67,59.67 132.65,61.66 LED_IC_1_STATUS.A
N$26
  Top 0.152: IC1.20 131.28,73.54 130.67,73.54 127.09,77.12 127.09,78.65 131.66,83.22 C31.2
N$27
  Top 0.152: R26.2 102.47,128.94 102.47,126.2 105.98,122.69 LED_IC_2_STATUS.A
N$28
  Top 0.152: IC2.20 111.77,138.77 112.61,138.77 115.12,141.29 115.12,141.67 C32.2
N$29
  Top 0.152: R27.2 79.54,56.63 79.54,59.45 77.33,61.66 LED_IC_3_STATUS.A
N$30  (via drill 0.35)
  Top 0.152: v73.06,78.57 74.28,78.57 74.89,77.96 74.89,77.35 IC3.20
  Bottom 0.152: v73.06,78.57 67.27,78.57 C33.2
RESET_0  (via drill 0.35)
  Top 0.152: 137.37,67.9 141.72,67.9 142.94,69.12 143.62,69.12 146.9,72.4 R28.1 | 137.37,67.9 136.31,67.9 135.93,68.29 135.93,68.9 IC1.29 | 137.37,67.9 v137.37,67.68
  Bottom 0.152: v137.37,67.68 137.37,66 124.88,53.5 124.88,34.07 119.01,28.2 119.01,23.18 117.71,21.88 117.71,21.04 J2.5
RESET_1
  Top 0.152: IC2.29 107.12,143.27 107.12,142.73 106.74,142.35 104.3,142.35 94.85,151.8 92.34,151.8 R29.1
  Bottom 0.152: J3.5 93.56,128.56 92.34,129.78 92.34,140.37 93.25,141.29 93.25,150.89 R29.1
RESET_2  (via drill 0.35)
  Top 0.152: IC3.29 70.32,72.78 69.71,72.78 67.96,74.53 67.96,78.34 63.08,83.22 R30.1 | v136.23,65.77 136.76,66.3 155.59,66.3 158.71,69.43 165.03,69.43 167.02,67.45 168.54,67.45 170.6,65.39 172.12,65.39 175.47,62.04 175.47,57.08 162.21,43.83 162.21,23.4 161.22,22.41 117.18,22.41 113.52,26.07 92.34,26.07 J5.5 | v132.57,65.39 125.56,65.39 122.67,68.29 v120.15,68.29
  Bottom 0.152: v136.23,65.77 135.16,65.77 134.78,65.39 v132.57,65.39 | v120.15,68.29 117.56,70.88 102.02,70.88 85.63,87.26 85.63,88.78 85.1,89.32 84.26,89.32 79.16,84.21 63.99,84.21 63.08,83.3 R30.1
SCK_1  (via drill 0.35)
  Top 0.152: v131.28,76.74 131.28,75.98 IC1.17 | v129.68,64.32 129.68,56.25 130.17,55.75 | 130.17,55.75 130.21,55.71 139.89,55.71 140.73,56.55 R25.1 | v122.36,32.47 123.58,32.47 126.32,35.21 126.32,44.82 130.13,48.63 130.13,55.71 130.17,55.75
  Bottom 0.152: v131.28,76.74 131.28,65.92 v129.68,64.32 | v122.36,32.47 116.49,26.6 116.49,25.61 117.64,24.47 117.64,23.63 J2.3
SCK_2
  Top 0.152: 111.77,129.93 111.77,129.86 112.61,129.02 R26.1 | 111.77,129.93 111.77,136.33 IC2.17 | 111.77,129.93 102.09,129.93 101.25,129.09 95.54,129.09 94.4,130.24 93.56,130.24 J3.3
SCK_3  (via drill 0.35)
  Top 0.152: v80.22,77.35 77.33,77.35 IC3.17
  Bottom 0.152: v80.22,77.35 80.22,74.46 69.48,63.71 69.48,56.63 R27.1 76.79,49.24 76.79,48.47 83.96,41.31 83.96,32.85 86.7,30.11 87.54,30.11 90.97,26.68 90.97,25.77 92.26,24.47 92.26,23.63 J5.3
SCL  (via drill 0.35)
  Top 0.152: 144.27,83.49 164.5,103.72 164.5,106 163.81,106.69 162.75,106.69 160.92,104.86 J1.3 | 144.27,83.49 143.62,82.84 143.62,77.73 140.27,74.38 139.66,74.38 IC1.6 | v74.66,74.31 74.66,72.55 75.65,71.56 75.65,68.97 IC3.6 | v67.35,75.68 65.52,75.68 59.88,81.32 59.88,81.93 53.1,88.71 53.1,103.41 J4.3 51.72,104.86 54.62,107.76 v54.62,117.89 | v90.97,137.93 103.31,137.93 IC2.6 103.39,137.93 104,137.93 v104.68,137.25 | 144.27,83.49 142.17,85.58 v140.65,85.58
  Bottom 0.152: v74.66,74.31 73.29,74.31 71.92,75.68 v67.35,75.68 | v90.97,137.93 90.97,138.62 87.69,141.89 78.62,141.89 v54.62,117.89 | v140.65,85.58 140.19,85.58 138.75,87.03 134.33,87.03 128.38,92.97 126.17,92.97 119.7,99.45 119.7,120.63 104.68,135.65 v104.68,137.25
SDA  (via drill 0.35)
  Top 0.152: v138.29,72.63 138.97,71.94 139.58,71.94 IC1.3 | v142.4,84.36 v142.4,77.58 | v70.24,67.9 72.83,67.9 73.29,68.36 73.29,68.9 IC3.3 | v68.87,68.29 68.87,71.87 49.13,91.6 49.13,104.86 J4.2 | v88.68,139.99 88.99,140.29 103.31,140.29 IC2.3 103.39,140.29 107.81,140.29 108.34,139.76 v110.02,139.76
  Bottom 0.152: v138.29,72.63 138.29,73.47 v142.4,77.58 | v142.4,84.36 156.19,98.16 156.19,102.73 J1.2 158.25,104.86 158.25,114.08 130.74,141.59 121.52,141.59 119.7,139.76 v110.02,139.76 | v70.24,67.9 69.25,67.9 v68.87,68.29 | v88.68,139.99 86.62,139.99 85.02,141.59 79.23,141.59 49.13,111.49 49.13,104.86 J4.2
TSOP_0  (via drill 0.35)
  Top 0.152: v75.12,78.65 107.96,78.65 111.92,74.69 121.83,74.69 125.33,71.18 131.28,71.18 IC1.23 | v61.78,71.94 61.78,71.33 62.55,70.57 62.55,69.96 60.94,68.36 49.59,68.36 48.52,69.43 41.89,69.43 34.5,62.04 v34.5,57.08 | v69.33,22.26 90.28,22.26 91.12,21.42 91.12,16.09 96.3,10.91 C1.+
  Bottom 0.152: v75.12,78.65 74.05,78.65 72.3,76.9 66.89,76.9 61.94,71.94 v61.78,71.94 | v69.33,22.26 v34.5,57.08 | R1.2 108.8,10.6 106.97,10.6 106.13,9.76 97.44,9.76 96.38,10.83 C1.+
TSOP_1  (via drill 0.35)
  Top 0.152: v127.7,53.2 127.7,62.8 124.11,66.38 120.23,66.38 115.5,71.1 115.5,72.25 116.11,72.86 123.2,72.86 125.71,70.34 131.28,70.34 IC1.24 | v123.12,30.41 123.12,25.84 v125.94,23.02 | C2.+ 138.21,12.2 136.76,12.2 134.55,14.41 R2.2
  Bottom 0.152: v127.7,53.2 130.13,50.76 130.13,47.03 125.18,42.07 125.18,32.47 v123.12,30.41 | v125.94,23.02 134.48,14.49 R2.2
TSOP_2  (via drill 0.35)
  Top 0.152: v118.63,68.9 132.65,68.9 IC1.25 | v84.64,65.62 84.64,57.31 79.54,52.21 79.54,45.73 84.72,40.55 84.72,27.82 85.86,26.68 88.53,26.68 92.87,31.02 123.43,31.02 126.32,28.13 126.32,26.91 128.15,25.08 156.88,25.08 R3.2 156.96,25.08 158.4,23.63 161.07,23.63 C3.+
  Bottom 0.152: v118.63,68.9 88.68,68.9 85.41,65.62 v84.64,65.62
TSOP_3  (via drill 0.35)
  Top 0.152: v137.83,70.27 134.25,70.27 133.49,69.5 133.49,68.97 IC1.26 | v152.77,65.69 v142.4,65.69 | v156.88,102.5 156.88,146.24 156.35,146.77 156.35,149.29 165.26,158.2 169.23,158.2 194.83,132.6 194.83,102.96 199.02,98.77 199.02,93.13 204.73,87.41 204.73,75.91 197.11,68.29 197.11,56.86 183.47,43.22 183.47,42.3 | C4.+ 183.47,42.3 | 183.47,42.3 181.04,42.3 180.05,41.31 175.78,41.31 R4.2
  Bottom 0.152: v142.4,65.69 v137.83,70.27 | v152.77,65.69 152.77,94.27 156.88,98.38 v156.88,102.5
TSOP_4
  Top 0.152: IC1.27 134.33,68.9 134.33,68.29 135.85,66.76 155.59,66.76 158.56,69.73 166.79,69.73 167.55,68.97 169.23,68.97 171.89,66.3 173.87,66.3 178.37,61.81 189.8,61.81 R5.2 189.88,61.81 194.37,61.81 195.51,62.95 C5.+
TSOP_5  (via drill 0.35)
  Top 0.152: v154.82,69.12 152.77,67.07 136.38,67.07 135.09,68.36 135.09,68.9 IC1.28 | C6.+ 203.74,87.03 203.06,87.03 201.23,85.2 198.1,85.2 R6.2
  Bottom 0.152: v154.82,69.12 154.82,69.28 159.47,73.92 159.47,142.73 156.35,145.86 156.35,149.29 165.26,158.2 169.23,158.2 194.83,132.6 194.83,88.4 198.03,85.2 R6.2
TSOP_6  (via drill 0.35)
  Top 0.152: v141.34,78.57 132.57,78.57 132.12,78.12 132.12,76.44 132.34,76.21 132.34,74.69 132.04,74.38 131.35,74.38 IC1.19 | v144.92,82.61 146.52,84.21 152.77,84.21 167.7,69.28 169.38,69.28 172.04,66.61 174.03,66.61 175.17,65.47 178.14,65.47 197.04,84.36 197.04,97.55 197.95,98.46 C7.+ 197.95,98.54 193.91,102.58 193.91,110.96 R7.2
  Bottom 0.152: v141.34,78.57 141.72,78.57 144.92,81.77 v144.92,82.61
TSOP_7
  Top 0.152: 194.68,135.11 195.36,134.43 R8.2 | 194.68,135.11 171.28,158.51 165.11,158.51 151.78,145.17 128.46,145.17 121.37,138.08 121.37,131.3 120.99,130.92 120.99,100.59 114.74,94.35 114.74,76.21 115.73,75.22 121.75,75.22 125.03,71.94 131.28,71.94 IC1.22 | 194.68,135.11 C8.+
TSOP_8
  Top 0.152: 183.4,158.13 184.69,156.83 R9.2 | 183.4,158.13 182.33,159.19 165.34,159.19 151.62,145.48 116.57,145.48 112.3,141.21 111.77,141.21 IC2.23 | 183.4,158.13 C9.+
TSOP_9  (via drill 0.35)
  Top 0.152: v110.4,141.97 111.69,141.97 IC2.24 | v110.4,145.7 110.86,145.7 120.91,155.76 129.07,155.76 133.72,151.11 134.86,151.11 147.13,163.38 147.13,165.97 149.87,168.72 151.39,168.72 152.23,169.56 161.22,169.56 161.87,168.91 | 161.87,168.91 163.66,167.12 C10.+ | 161.87,168.91 168.54,175.58 R10.2
  Bottom 0.152: v110.4,145.7 v110.4,141.97
TSOP_10
  Top 0.152: IC2.25 110.4,143.34 112.99,143.34 115.43,145.78 134.71,145.78 145.83,156.91 C11.+ 145.91,156.98 148.04,159.12 148.04,165.52 R11.2
TSOP_11
  Top 0.152: IC2.26 109.56,143.34 109.56,143.95 120.3,154.7 124.65,154.7 R12.2 124.65,154.62 130.59,148.68 130.59,146.77 C12.+
TSOP_12
  Top 0.152: 106.86,145.74 102.32,150.28 99.96,150.28 R13.2 | 106.86,145.74 108.72,143.88 108.72,143.34 IC2.27 | 106.86,145.74 112.84,151.72 112.84,154.39 C13.+
TSOP_13
  Top 0.152: 77.33,153.02 76.34,153.02 75.5,152.18 R14.2 | 77.33,153.02 94.09,153.02 97.67,149.44 102.4,149.44 107.88,143.95 107.88,143.34 IC2.28 | 77.33,153.02 77.33,146.77 C14.+
TSOP_14
  Top 0.152: IC2.19 111.77,137.93 112.38,137.93 113.52,136.79 113.52,128.64 109.87,124.98 109.48,124.98 108.34,123.84 108.34,120.56 108.19,120.41 101.64,120.41 94.78,127.26 94.78,128.18 93.86,129.09 93.03,129.09 88.61,133.51 88.61,138.08 80.91,145.78 73.21,145.78 C15.+ 58.58,160.41 53.1,160.41 R15.2
TSOP_15  (via drill 0.35)
  Top 0.152: v108.65,140.37 111.69,140.37 IC2.22 | C16.+ 42.96,168.41 34.27,168.41 R16.2
  Bottom 0.152: v108.65,140.37 105.06,140.37 84.8,160.64 62.93,160.64 56.22,167.35 56.22,167.65 55.53,168.34 48.91,168.34 46.7,166.13 45.25,166.13 C16.+
TSOP_16
  Top 0.152: C17.+ 23.68,163 25.13,163 26.43,161.71 42.2,161.71 55.23,148.68 55.23,97.77 72.45,80.55 72.45,77.35 IC3.23
  Bottom 0.152: C17.+ 22.69,151.42 20.18,148.91 20.18,147.99 R17.2
TSOP_17  (via drill 0.35)
  Top 0.152: v55.08,93.96 71.69,77.35 IC3.24
  Bottom 0.152: v55.08,93.96 55.08,94.12 45.48,103.72 45.48,134.2 53.63,142.35 53.63,149.29 44.71,158.2 31.84,158.2 13.78,140.14 12.25,140.14 C18.+ 11.34,139.15 11.87,138.62 11.87,124.6 R18.2
TSOP_18  (via drill 0.35)
  Top 0.152: v68.56,76.29 68.87,75.98 70.32,75.98 IC3.25 | R19.2 16.06,111.41 16.06,102.58 12.02,98.54 C19.+
  Bottom 0.152: v68.56,76.29 67.04,76.29 59.12,68.36 49.59,68.36 48.52,69.43 40.83,69.43 36.87,65.47 31.84,65.47 12.94,84.36 12.94,97.55 12.02,98.46 C19.+
TSOP_19  (via drill 0.35)
  Top 0.152: v71.61,75.07 70.39,75.07 IC3.26 | v61.94,70.27 42.28,70.27 37.48,65.47 24.45,65.47 14.62,75.3 R20.2
  Bottom 0.152: v71.61,75.07 66.74,75.07 v61.94,70.27 | C20.+ 6.23,87.03 6.23,86.73 14.54,78.42 R20.2
TSOP_20  (via drill 0.35)
  Top 0.152: v69.02,74.38 70.32,74.38 IC3.27 | v68.26,69.96 68.26,55.64 80.83,43.06 81.75,43.06 83.65,41.16 83.65,26.91 81.82,25.08 58.13,25.08 30.31,52.89 25.28,52.89 R21.2
  Bottom 0.152: v69.02,74.38 69.02,70.72 v68.26,69.96 | C21.+ 14.46,62.95 18.35,59.07 19.11,59.07 25.21,52.97 R21.2
TSOP_21  (via drill 0.35)
  Top 0.152: v72.68,73.54 70.39,73.54 IC3.28 | v85.63,66.76 85.63,65.62 85.33,65.31 85.33,33.77 87.01,32.09 87.01,29.8 v85.33,28.13 | v84.34,27.14 81.98,24.78 54.85,24.78 45.55,34.07 41.44,34.07 R22.2
  Bottom 0.152: v72.68,73.54 74.81,73.54 78.55,77.28 78.55,78.5 84.26,84.21 85.1,84.21 85.63,83.68 v85.63,66.76 | v84.34,27.14 v85.33,28.13 | C22.+ 26.5,41.31 27.19,41.31 30.24,38.26 37.25,38.26 41.36,34.15 R22.2
TSOP_22  (via drill 0.35)
  Top 0.152: v87.92,28.81 92.19,33.08 123.73,33.08 124.65,34 124.65,65.39 123.96,66.08 120.08,66.08 107.81,78.34 76.11,78.34 75.73,77.96 75.73,77.35 IC3.19
  Bottom 0.152: v87.92,28.81 83.96,24.85 83.96,21.5 73.67,11.21 71.38,11.21 70.62,11.97 70.62,12.58 63.23,19.97 61.94,19.97 R23.2 61.86,20.05 59.73,22.18 48.91,22.18 47.53,23.56 46.85,23.56 C23.+
TSOP_23  (via drill 0.35)
  Top 0.152: v76.18,48.63 76.18,51.14 69.4,57.92 69.4,63.79 69.48,63.87 69.48,68.06 73.29,71.87 73.29,77.28 IC3.22 | C24.+ 74.97,15.4 76.26,15.4 79.84,11.82 85.25,11.82 R24.2
  Bottom 0.152: v76.18,48.63 83.65,41.16 83.65,24.09 C24.+
TSOP_PWR_0  (via drill 0.35)
  Top 0.152: TSOP_4.V+ 173.19,33 173.19,32.24 158.18,17.23 154.44,17.23 153.83,17.84 TSOP_3.V+ 152.23,17.84 151.09,17.84 140.5,7.25 130.36,7.25 129.07,8.54 128.23,8.54 TSOP_2.V+ | v139.81,77.96 139.51,78.27 137.07,78.27 136.69,77.89 136.69,77.35 IC1.11 | v144.23,82 144.23,82.84 145.91,84.52 153.38,84.52 v163.28,74.61 | v187.36,55.26 189.42,53.2 TSOP_5.V+
  Bottom 0.152: TSOP_1.V+ 102.47,5.88 102.7,5.88 105.37,8.54 128.15,8.54 TSOP_2.V+ | TSOP_8.V+ 201.31,128.03 201.31,112.33 205.88,107.76 205.88,104.18 204.05,102.35 TSOP_7.V+ 203.97,102.27 202.91,101.2 202.91,86.65 203.13,86.42 203.13,79.11 200.85,76.82 200.01,76.82 TSOP_6.V+ 199.93,76.74 199.93,62.72 192.62,55.41 192.62,54.49 191.32,53.2 189.49,53.2 TSOP_5.V+ 189.42,53.12 189.42,46.04 176.46,33.08 173.26,33.08 TSOP_4.V+ | v139.81,77.96 143.85,82 v144.23,82 | v163.28,74.61 163.28,73.7 172.96,64.02 178.6,64.02 v187.36,55.26
TSOP_PWR_1  (via drill 0.35)
  Top 0.152: 176.73,168.15 175.55,166.96 166.94,166.96 165.19,165.21 156.73,165.21 TSOP_11.V+ | 176.73,168.15 176.77,168.18 176.77,173.06 TSOP_10.V+ | TSOP_9.V+ 192.01,153.71 192.62,154.32 192.62,157.97 182.48,168.11 176.77,168.11 176.73,168.15 | TSOP_16.V+ 36.79,176.64 47.99,176.64 56.83,167.8 57.67,167.8 TSOP_15.V+ 57.74,167.73 62.16,167.73 70.62,159.27 80.53,159.27 81.75,158.05 TSOP_14.V+ 103.92,157.97 107.5,154.39 TSOP_13.V+ 107.58,154.39 108.57,155.38 115.96,155.38 120.46,159.88 130.67,159.88 133.03,157.52 133.03,156.68 TSOP_12.V+ | v106.36,136.26 106.36,135.04 IC2.11
  Bottom 0.152: TSOP_12.V+ 133.11,156.6 144.92,156.6 145.53,155.99 148.35,155.99 156.65,164.3 156.65,165.14 TSOP_11.V+ | v106.36,136.26 106.36,137.17 109.26,140.07 109.26,149.82 107.58,151.5 107.58,154.32 TSOP_13.V+
TSOP_PWR_2  (via drill 0.35)
  Top 0.152: v81.14,70.04 79.31,71.87 78.7,71.87 IC3.11 | v81.14,52.89 81.14,52.05 79.84,50.76 79.84,48.09 v84.49,43.44 | v87.61,31.48 87.61,29.42 87.31,29.12 v87.31,27.29 | TSOP_22.V+ 33.13,36.66 31.84,36.66 27.57,40.93 27.57,41.62 17.36,51.83 17.36,55.41 17.97,56.02 TSOP_21.V+ 17.97,57.62 14.84,60.74 14.84,63.18 7.38,70.65 7.38,79.49 8.67,80.78 8.67,81.62 TSOP_20.V+
  Bottom 0.152: TSOP_20.V+ 8.67,81.7 8.67,83.3 4.1,87.87 4.1,105.55 5.93,107.38 TSOP_19.V+ 6,107.45 6,110.27 6.84,111.11 6.84,130.62 9.13,132.9 9.97,132.9 TSOP_18.V+ 10.04,132.98 10.04,139.23 21.09,150.28 21.09,154.47 20.56,155 20.56,156.53 TSOP_17.V+ | v81.14,52.89 v81.14,70.04 | v84.49,43.44 84.49,41.69 85.33,40.85 85.33,33.77 v87.61,31.48 | v87.31,27.29 87.31,20.28 76.95,9.92 TSOP_24.V+ 76.87,9.92 62.85,9.92 55.53,17.23 54.62,17.23 53.32,18.53 53.32,20.36 TSOP_23.V+ 53.25,20.43 46.77,20.43 33.21,34 33.21,36.59 TSOP_22.V+
VCC_5V
  Bottom 0.508: 57.97,86.42 57.97,93.51 46.62,104.86 J4.1 | 57.97,86.42 57.97,69.35 D3.A | 119.16,99.22 119.16,108.82 117.71,110.27 117.71,118.81 D2.A | 119.16,99.22 133.18,85.2 139.81,85.2 140.27,84.74 141.56,84.74 | 141.56,84.74 144.08,87.26 144.46,87.26 155.66,98.46 155.66,104.79 155.74,104.86 J1.1 | 141.56,84.74 141.56,83.98 142.02,83.53 142.78,83.53 143.7,84.44 147.36,84.44 151.93,79.87 151.93,64.25 D1.A | 57.97,86.42 80.6,86.42 84.19,90 109.79,90 118.93,99.15 119.16,99.22
VCC_IC_1  (via drill 0.61)
  Top 0.508: v127.92,77.58 130.36,75.14 131.28,75.14 IC1.18 | v143.32,69.96 140.57,72.71 139.66,72.71 IC1.4
  Bottom 0.508: 127.92,84.44 127.92,85.74 C37.1 125.11,88.4 119.01,88.4 C38.1 | 127.92,84.44 v127.92,77.58 | J2.2 120.23,26.3 126.17,32.24 126.17,42.3 139.66,55.79 139.66,59.45 144.23,64.02 D1.C 144.31,64.25 143.32,65.24 v143.32,69.96 143.39,70.19 145.76,72.55 145.76,82.99 145.3,83.45 144.46,83.45 143.77,82.76 141.18,82.76 139.51,84.44 127.92,84.44
VCC_IC_2  (via drill 0.61)
  Top 0.508: D2.C 117.71,126.5 117.71,129.02 C40.1 C39.1 | 104.84,139.53 103.39,139.53 IC2.4 | 104.84,139.53 107.12,139.53 109.48,137.17 111.69,137.17 IC2.18 | v104.84,139.3 104.84,139.53
  Bottom 0.508: J3.2 96.15,132.83 97.22,132.83 103.69,139.3 v104.84,139.3 104.91,139.08 105.52,138.47 105.52,135.87 105.98,135.42 115.58,135.42 116.72,136.56 120.23,136.56 C39.1
VCC_IC_3  (via drill 0.61)
  Top 0.508: C41.1 84.72,83.3 90.97,83.3 C42.1 | v73.52,70.42 74.05,69.89 74.05,68.97 IC3.4 | v75.65,72.71 75.65,74.38 76.49,75.22 76.49,77.28 IC3.18 | J5.2 64.6,21.04 59.34,15.78 53.02,15.78 38.62,30.19 38.62,38.49 34.5,42.61 32.98,42.61 22.54,53.05 22.54,65.62 13.32,74.84 13.32,99.07 21.17,106.92 21.17,138.85 40.68,158.35 44.79,158.35 53.78,149.36 53.78,112.02 47.84,106.08 47.84,87.11 65.59,69.35 D3.C
  Bottom 0.508: D3.C 65.67,69.28 65.82,69.12 68.64,69.12 69.94,70.42 v73.52,70.42 73.59,70.65 v75.65,72.71 75.73,72.93 79.08,76.29 79.08,77.43 84.64,82.99 84.64,83.22 C41.1
XTAL1_0
  Top 0.152: IC1.7 139.58,75.14 137.53,75.14 132.12,69.73 125.03,69.73 122.82,71.94 Q1.2 122.82,71.87 116.42,71.87 C26.2
XTAL1_1  (via drill 0.35)
  Top 0.152: v100.26,134.66 102.7,137.09 103.31,137.09 IC2.7 | v91.35,120.56 91.35,99.22 102.17,88.4 102.4,88.4 C28.2 102.55,88.25 102.55,80.78 Q2.2
  Bottom 0.152: v100.26,134.66 100.26,129.47 v91.35,120.56
XTAL1_2
  Top 0.152: IC3.7 76.57,68.97 76.57,74.53 77.71,75.68 77.71,76.29 78.17,76.74 87.16,76.74 Q3.2 87.31,76.9 93.56,76.9 C30.2
XTAL2_0
  Top 0.152: IC1.8 139.66,75.98 141.95,78.27 141.95,78.88 138.52,82.31 133.94,82.31 132.04,84.21 130.21,84.21 122.82,76.82 Q1.1 122.82,76.9 116.42,76.9 C25.2
XTAL2_1  (via drill 0.35)
  Top 0.152: v101.64,134.66 103.31,136.33 IC2.8 | v101.33,90.84 105.06,90.84 107.5,88.4 C27.2 107.43,88.4 107.43,80.78 Q2.1
  Bottom 0.152: v101.64,134.66 101.64,129.47 91.35,119.19 91.35,99.22 99.73,90.84 v101.33,90.84
XTAL2_2
  Top 0.152: IC3.8 77.33,68.97 84.19,68.97 87.16,71.94 Q3.1 87.16,71.87 93.56,71.87 C29.2

### Text on the board
tNames: IRON MAN | THOR | CAPTAIN AMERICA